# EAGLE design DSP_Lab_SS21_Mainboard (EAGLE 6.6.0)

## Sheet 1 of 4
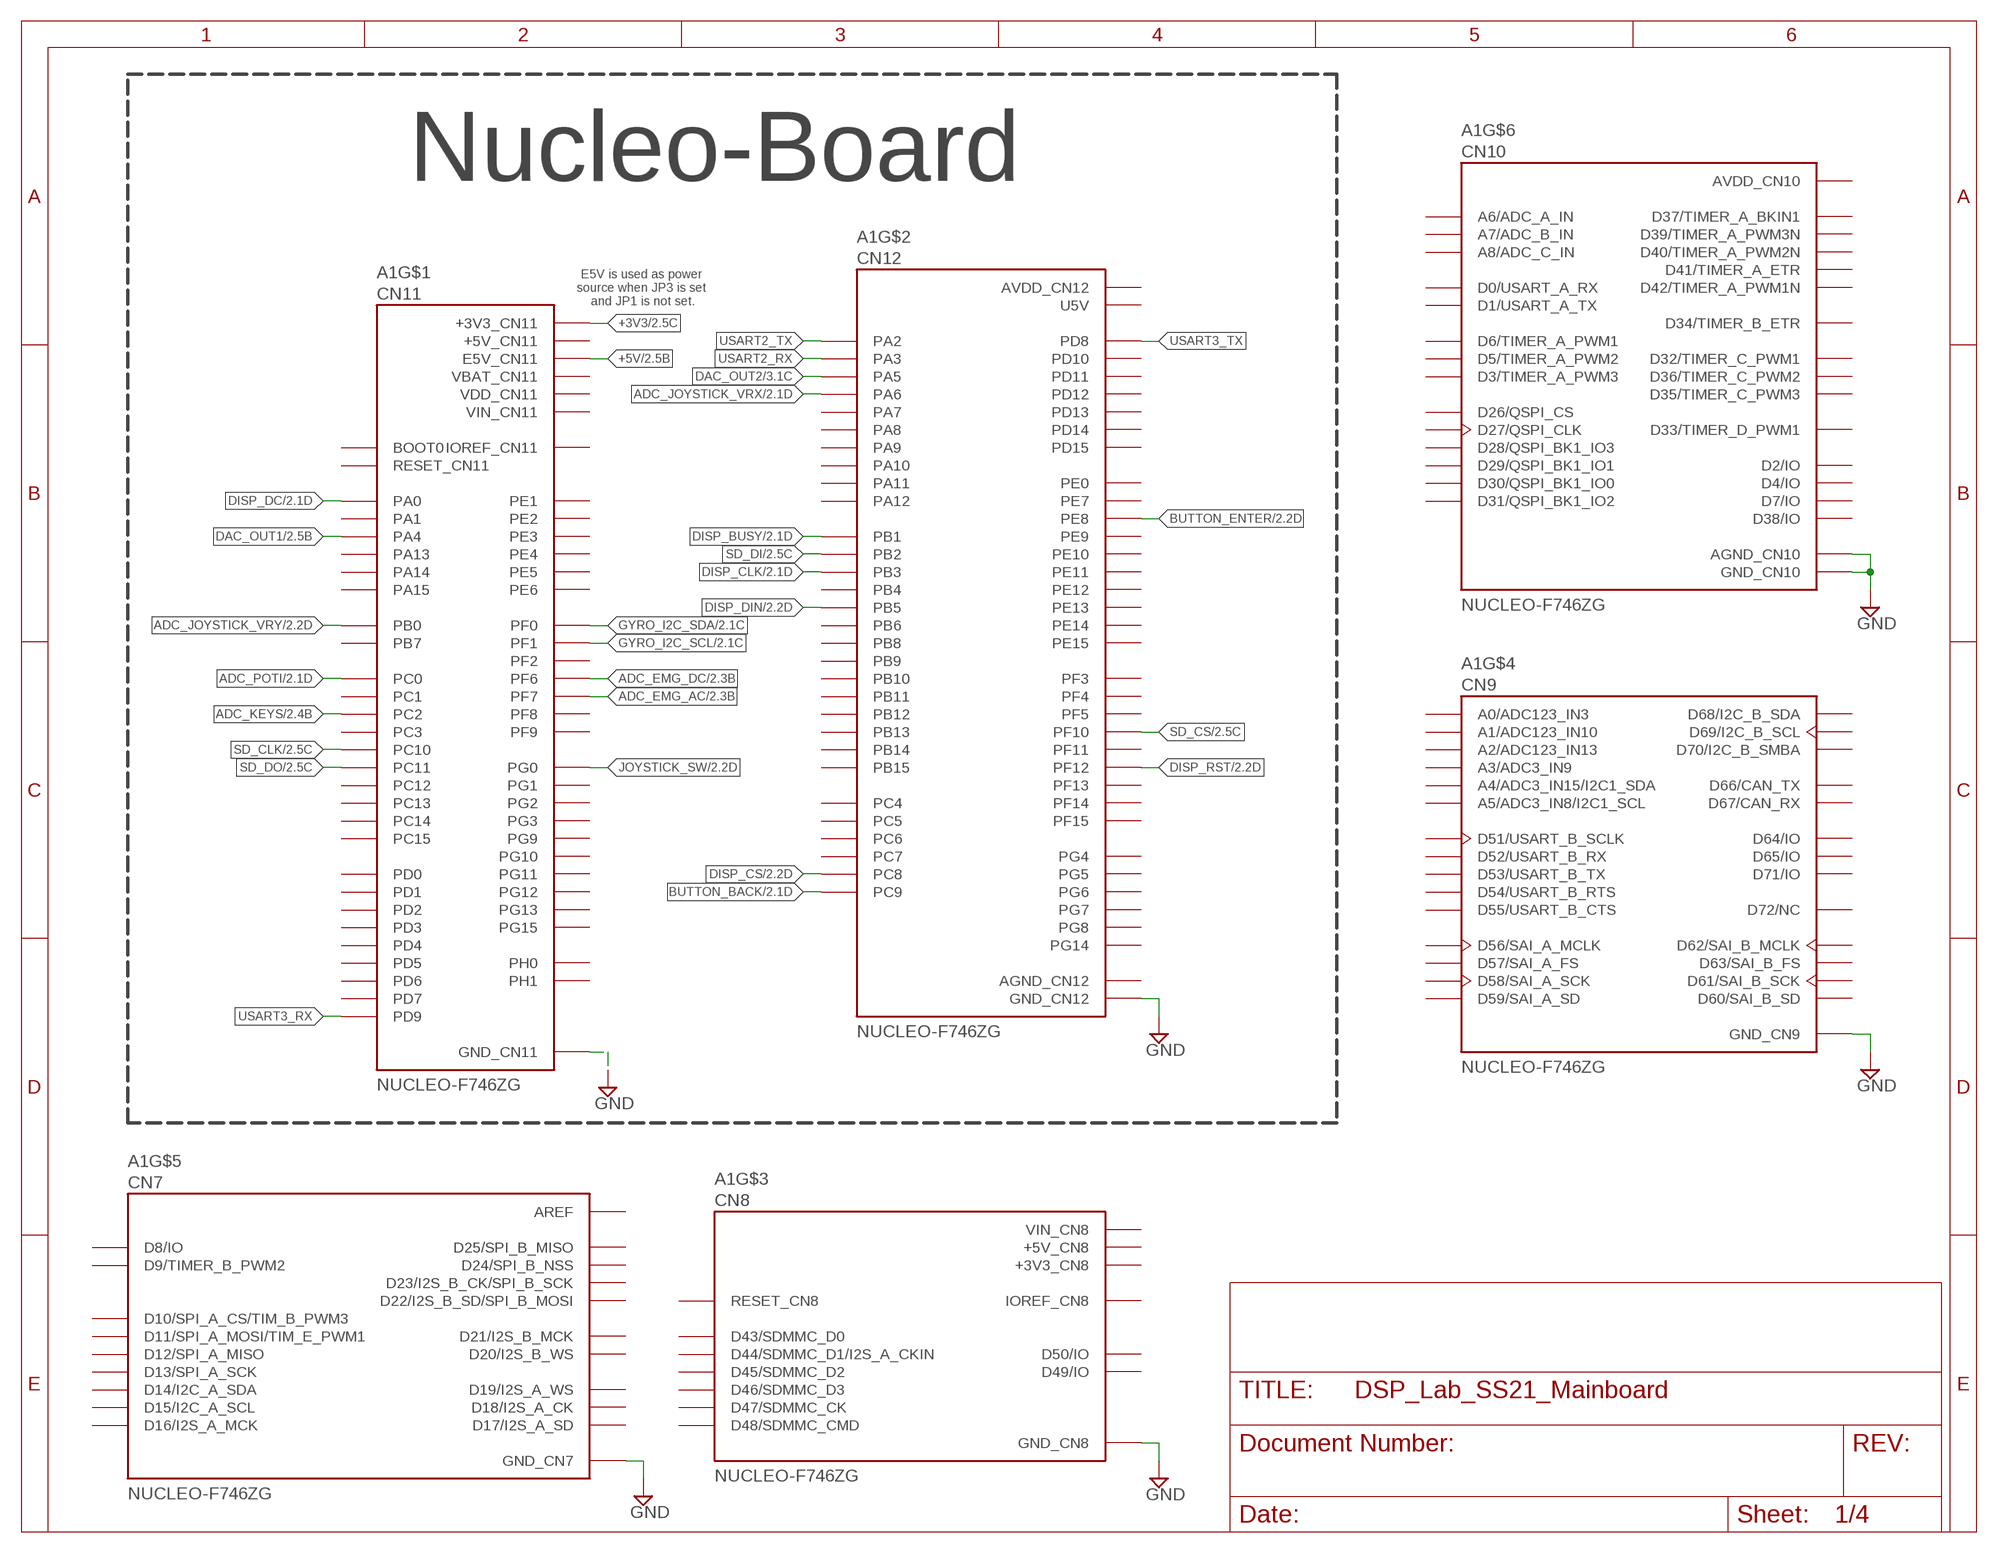
[diagram p0: schematic, sheet 1]

### Parts
A1  NUCLEO-F746ZG  [MODULE_NUCLEO-F746ZG]

### Nets
+3V3: A1.CN11_16(+3V3_CN11) ; also sheet 2,4
+5V: A1.CN11_6(E5V_CN11) ; also sheet 2,3,4
ADC_EMG_AC: A1.CN11_11(PF7) ; also sheet 2
ADC_EMG_DC: A1.CN11_9(PF6) ; also sheet 2
ADC_JOYSTICK_VRX: A1.CN12_13(PA6) ; also sheet 2,4
ADC_JOYSTICK_VRY: A1.CN11_34(PB0) ; also sheet 2,4
ADC_KEYS: A1.CN11_35(PC2) ; also sheet 2
ADC_POTI: A1.CN11_38(PC0) ; also sheet 2,4
BUTTON_BACK: A1.CN12_1(PC9) ; also sheet 2
BUTTON_ENTER: A1.CN12_40(PE8) ; also sheet 2
DAC_OUT1: A1.CN11_32(PA4) ; also sheet 2,3
DAC_OUT2: A1.CN12_11(PA5) ; also sheet 3
DISP_BUSY: A1.CN12_24(PB1) ; also sheet 2
DISP_CLK: A1.CN12_31(PB3) ; also sheet 2
DISP_CS: A1.CN12_2(PC8) ; also sheet 2
DISP_DC: A1.CN11_28(PA0) ; also sheet 2
DISP_DIN: A1.CN12_29(PB5) ; also sheet 2
DISP_RST: A1.CN12_59(PF12) ; also sheet 2
GND: A1.CN7_8(GND_CN7) A1.CN8_11(GND_CN8) A1.CN8_13(GND_CN8) A1.CN9_12(GND_CN9) A1.CN9_23(GND_CN9) A1.CN10_3(AGND_CN10) A1.CN10_5(GND_CN10) A1.CN10_17(GND_CN10) A1.CN10_22(GND_CN10) A1.CN10_27(GND_CN10) A1.CN11_8(GND_CN11) A1.CN11_19(GND_CN11) A1.CN11_20(GND_CN11) A1.CN11_22(GND_CN11) A1.CN11_49(GND_CN11) A1.CN11_60(GND_CN11) A1.CN11_71(GND_CN11) A1.CN11_72(GND_CN11) A1.CN12_9(GND_CN12) A1.CN12_20(GND_CN12) A1.CN12_39(GND_CN12) A1.CN12_54(GND_CN12) A1.CN12_63(GND_CN12) A1.CN12_71(GND_CN12) A1.CN12_72(GND_CN12) ; also sheet 2,3,4
GYRO_I2C_SCL: A1.CN11_51(PF1) ; also sheet 2
GYRO_I2C_SDA: A1.CN11_53(PF0) ; also sheet 2
JOYSTICK_SW: A1.CN11_59(PG0) ; also sheet 2
SD_CLK: A1.CN11_1(PC10) ; also sheet 2
SD_CS: A1.CN12_42(PF10) ; also sheet 2
SD_DI: A1.CN12_22(PB2) ; also sheet 2
SD_DO: A1.CN11_2(PC11) ; also sheet 2
USART2_RX: A1.CN12_37(PA3)
USART2_TX: A1.CN12_35(PA2)
USART3_RX: A1.CN11_69(PD9)
USART3_TX: A1.CN12_10(PD8)
Unconnected: A1.CN7_1(D16/I2S_A_MCK) A1.CN7_2(D15/I2C_A_SCL) A1.CN7_3(D17/I2S_A_SD) A1.CN7_4(D14/I2C_A_SDA) A1.CN7_5(D18/I2S_A_CK) A1.CN7_7(D19/I2S_A_WS) A1.CN7_9(D20/I2S_B_WS) A1.CN7_10(D13/SPI_A_SCK) A1.CN7_11(D21/I2S_B_MCK) A1.CN7_12(D12/SPI_A_MISO) A1.CN7_13(D22/I2S_B_SD/SPI_B_MOSI) A1.CN7_14(D11/SPI_A_MOSI/TIM_E_PWM1) A1.CN7_15(D23/I2S_B_CK/SPI_B_SCK) A1.CN7_16(D10/SPI_A_CS/TIM_B_PWM3) A1.CN7_17(D24/SPI_B_NSS) A1.CN7_18(D9/TIMER_B_PWM2) A1.CN7_19(D25/SPI_B_MISO) A1.CN7_20(D8/IO) A1.CN8_2(D43/SDMMC_D0) A1.CN8_3(IOREF_CN8) A1.CN8_4(D44/SDMMC_D1/I2S_A_CKIN) A1.CN8_5(RESET_CN8) A1.CN8_6(D45/SDMMC_D2) A1.CN8_8(D46/SDMMC_D3) A1.CN8_10(D47/SDMMC_CK) A1.CN8_12(D48/SDMMC_CMD) A1.CN8_14(D49/IO) A1.CN8_16(D50/IO) A1.CN9_1(A0/ADC123_IN3) A1.CN9_2(D51/USART_B_SCLK) A1.CN9_3(A1/ADC123_IN10) A1.CN9_4(D52/USART_B_RX) A1.CN9_5(A2/ADC123_IN13) A1.CN9_6(D53/USART_B_TX) A1.CN9_7(A3/ADC3_IN9) A1.CN9_8(D54/USART_B_RTS) A1.CN9_9(A4/ADC3_IN15/I2C1_SDA) A1.CN9_10(D55/USART_B_CTS) A1.CN9_11(A5/ADC3_IN8/I2C1_SCL) A1.CN9_13(D72/NC) A1.CN9_14(D56/SAI_A_MCLK) A1.CN9_15(D71/IO) A1.CN9_16(D57/SAI_A_FS) A1.CN9_17(D70/I2C_B_SMBA) A1.CN9_18(D58/SAI_A_SCK) A1.CN9_19(D69/I2C_B_SCL) A1.CN9_20(D59/SAI_A_SD) A1.CN9_21(D68/I2C_B_SDA) A1.CN9_22(D60/SAI_B_SD) A1.CN9_24(D61/SAI_B_SCK) A1.CN9_25(D67/CAN_RX) A1.CN9_26(D62/SAI_B_MCLK) A1.CN9_27(D66/CAN_TX) A1.CN9_28(D63/SAI_B_FS) A1.CN9_29(D65/IO) A1.CN9_30(D64/IO) A1.CN10_2(D7/IO) A1.CN10_4(D6/TIMER_A_PWM1) A1.CN10_6(D5/TIMER_A_PWM2) A1.CN10_7(A6/ADC_A_IN) A1.CN10_8(D4/IO) A1.CN10_9(A7/ADC_B_IN) A1.CN10_10(D3/TIMER_A_PWM3) A1.CN10_11(A8/ADC_C_IN) A1.CN10_12(D2/IO) A1.CN10_13(D26/QSPI_CS) A1.CN10_14(D1/USART_A_TX) A1.CN10_15(D27/QSPI_CLK) A1.CN10_16(D0/USART_A_RX) A1.CN10_18(D42/TIMER_A_PWM1N) A1.CN10_19(D28/QSPI_BK1_IO3) A1.CN10_20(D41/TIMER_A_ETR) A1.CN10_21(D29/QSPI_BK1_IO1) A1.CN10_23(D30/QSPI_BK1_IO0) A1.CN10_24(D40/TIMER_A_PWM2N) A1.CN10_25(D31/QSPI_BK1_IO2) A1.CN10_26(D39/TIMER_A_PWM3N) A1.CN10_28(D38/IO) A1.CN10_29(D32/TIMER_C_PWM1) A1.CN10_30(D37/TIMER_A_BKIN1) A1.CN10_31(D33/TIMER_D_PWM1) A1.CN10_32(D36/TIMER_C_PWM2) A1.CN10_33(D34/TIMER_B_ETR) A1.CN10_34(D35/TIMER_C_PWM3) A1.CN11_3(PC12) A1.CN11_4(PD2) A1.CN11_7(BOOT0) A1.CN11_12(IOREF_CN11) A1.CN11_13(PA13) A1.CN11_14(RESET_CN11) A1.CN11_15(PA14) A1.CN11_17(PA15) A1.CN11_21(PB7) A1.CN11_23(PC13) A1.CN11_25(PC14) A1.CN11_27(PC15) A1.CN11_29(PH0) A1.CN11_30(PA1) A1.CN11_31(PH1) A1.CN11_36(PC1) A1.CN11_37(PC3) A1.CN11_39(PD4) A1.CN11_40(PD3) A1.CN11_41(PD5) A1.CN11_42(PG2) A1.CN11_43(PD6) A1.CN11_44(PG3) A1.CN11_45(PD7) A1.CN11_46(PE2) A1.CN11_47(PE3) A1.CN11_48(PE4) A1.CN11_50(PE5) A1.CN11_52(PF2) A1.CN11_54(PF8) A1.CN11_55(PD1) A1.CN11_56(PF9) A1.CN11_57(PD0) A1.CN11_58(PG1) A1.CN11_61(PE1) A1.CN11_62(PE6) A1.CN11_63(PG9) A1.CN11_64(PG15) A1.CN11_65(PG12) A1.CN11_66(PG10) A1.CN11_68(PG13) A1.CN11_70(PG11) A1.CN12_3(PB8) A1.CN12_4(PC6) A1.CN12_5(PB9) A1.CN12_6(PC5) A1.CN12_12(PA12) A1.CN12_14(PA11) A1.CN12_15(PA7) A1.CN12_16(PB12) A1.CN12_17(PB6) A1.CN12_18(PB11) A1.CN12_19(PC7) A1.CN12_21(PA9) A1.CN12_23(PA8) A1.CN12_25(PB10) A1.CN12_26(PB15) A1.CN12_27(PB4) A1.CN12_28(PB14) A1.CN12_30(PB13) A1.CN12_33(PA10) A1.CN12_34(PC4) A1.CN12_36(PF5) A1.CN12_38(PF4) A1.CN12_41(PD13) A1.CN12_43(PD12) A1.CN12_44(PE7) A1.CN12_45(PD11) A1.CN12_46(PD14) A1.CN12_47(PE10) A1.CN12_48(PD15) A1.CN12_49(PE12) A1.CN12_50(PF14) A1.CN12_51(PE14) A1.CN12_52(PE9) A1.CN12_53(PE15) A1.CN12_55(PE13) A1.CN12_56(PE11) A1.CN12_57(PF13) A1.CN12_58(PF3) A1.CN12_60(PF15) A1.CN12_61(PG14) A1.CN12_62(PF11) A1.CN12_64(PE0) A1.CN12_65(PD10) A1.CN12_66(PG8) A1.CN12_67(PG7) A1.CN12_68(PG5) A1.CN12_69(PG4) A1.CN12_70(PG6)

### Notes on the sheet
- Nucleo-Board
- E5V is used as power 
  source when JP3 is set 
  and JP1 is not set.

## Sheet 2 of 4
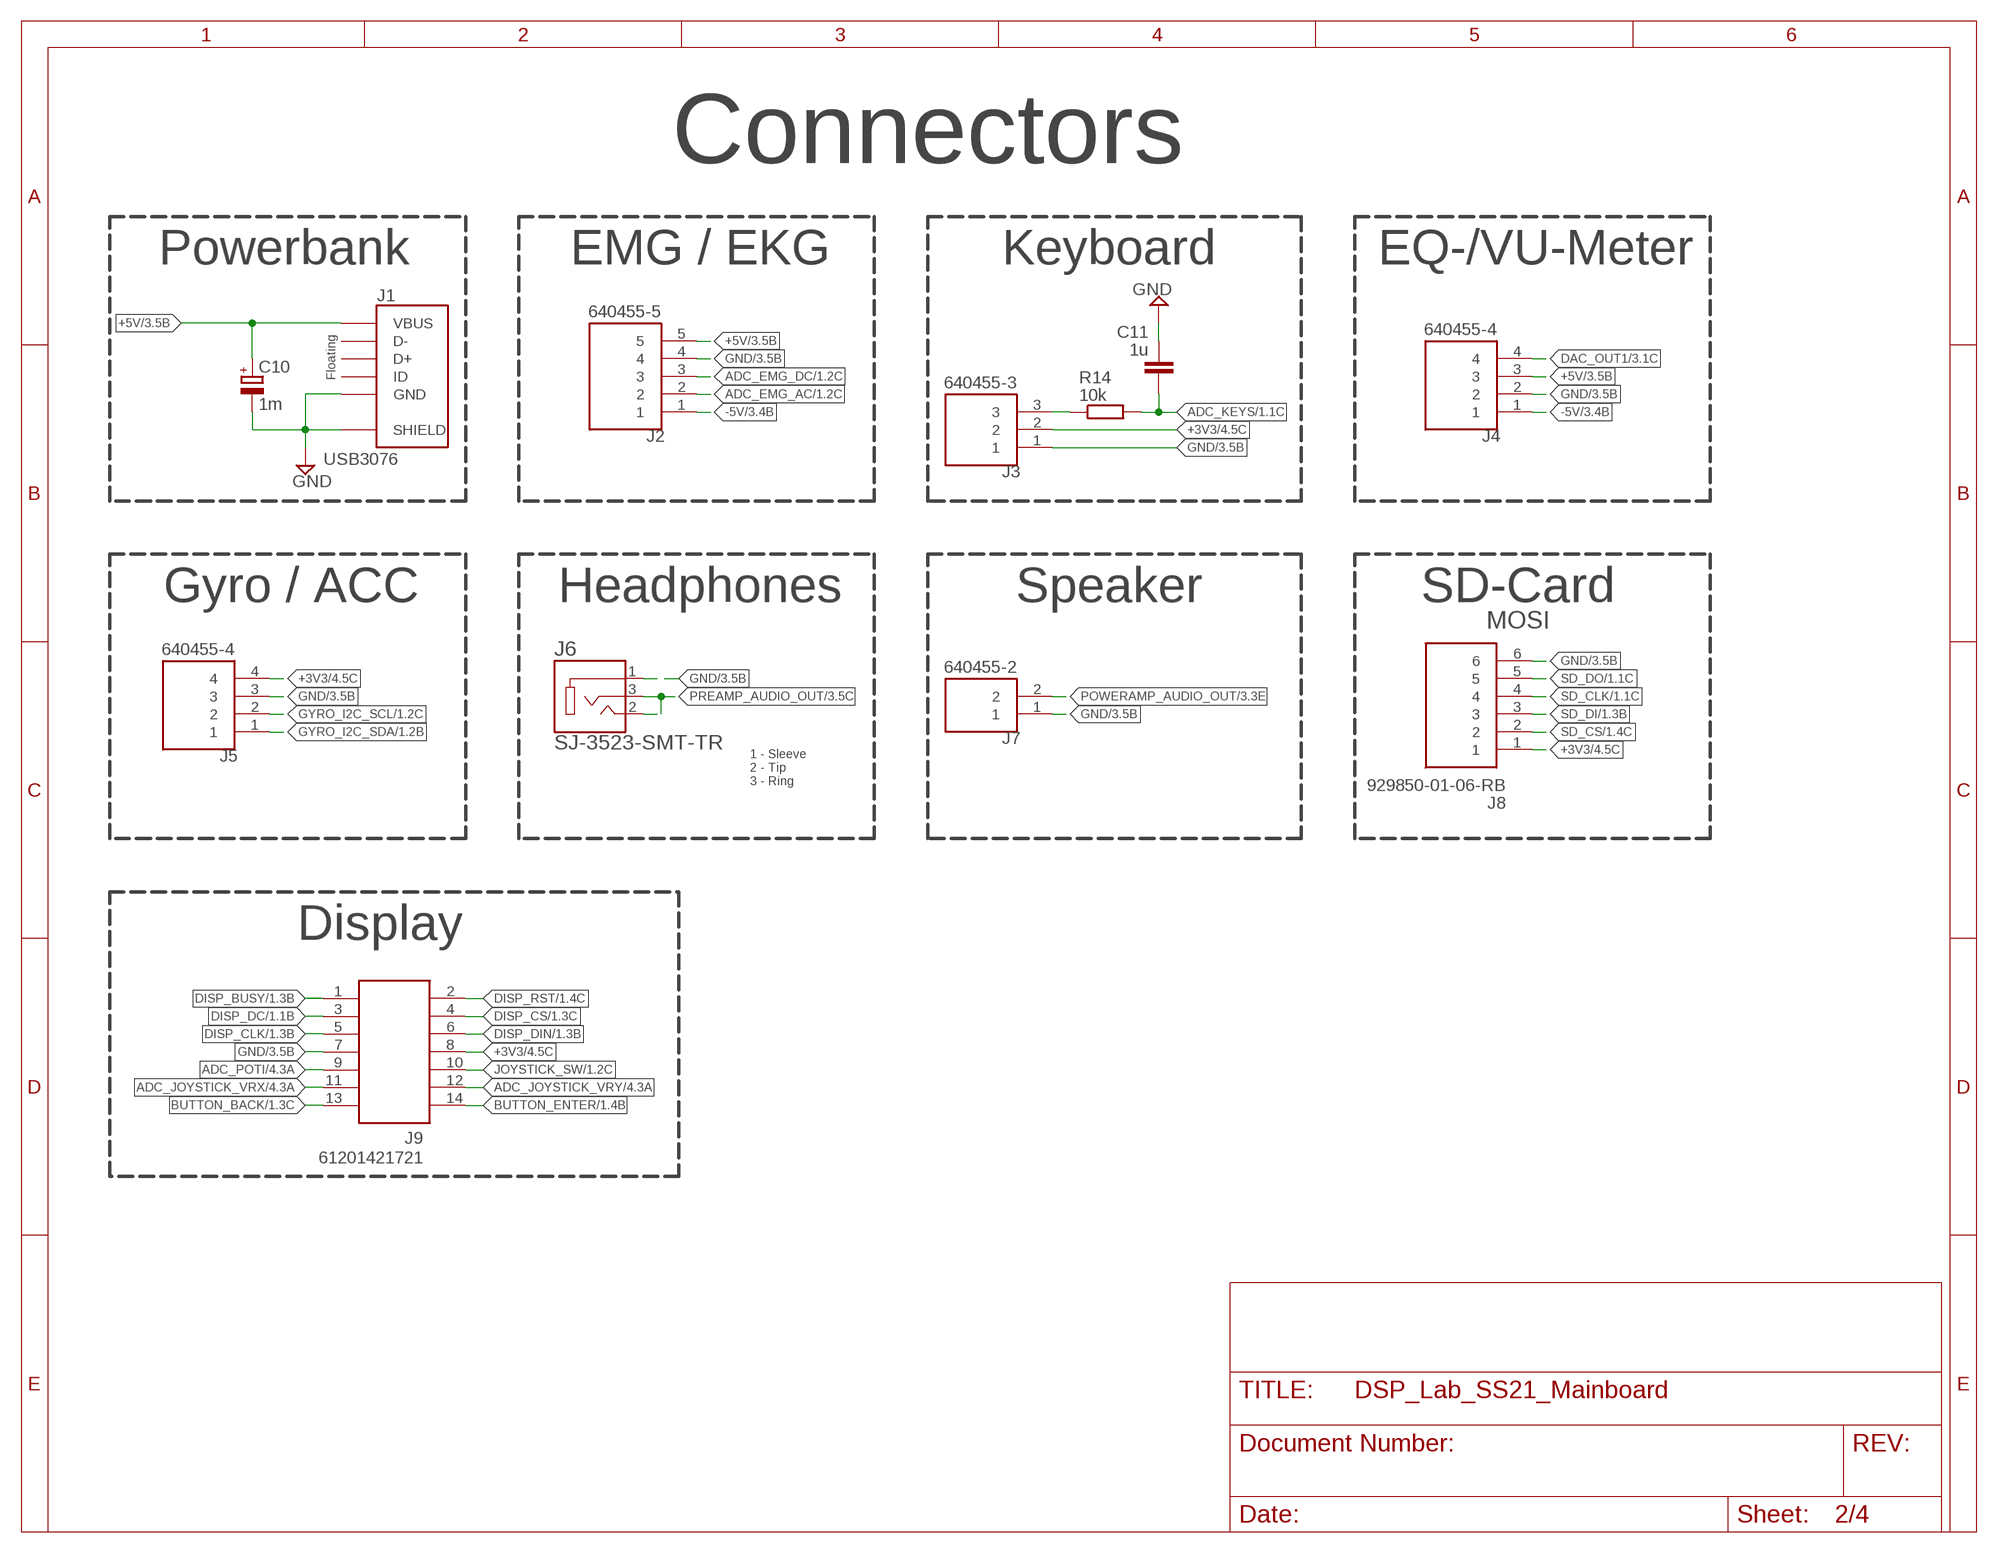
[diagram p1: schematic, sheet 2]

### Parts
C10  1m  CPOL-EUE2.5-5  [E2,5-5]
C11  1u  C-EUC0603  [C0603]
J1  USB3076  USB3076-XX-X_REVC  [GCT_USB3076-XX-X_REVC]
J2  640455-5  [TE_640455-5]
J3  640455-3  [TE_640455-3]
J4  640455-4  [TE_640455-4]
J5  640455-4  [TE_640455-4]
J6  SJ-3523-SMT-TR  [CUI_SJ-3523-SMT-TR]
J7  640455-2  [TE_640455-2]
J8  929850-01-06-RB  [RHDR6W76P0X254_1X6_1524X254X82]
J9  61201421721  [61201421721]
R14  10k  R-EU_R0603  [R0603]

### Nets
+3V3: J3.2 J5.4 J8.1 J9.8 ; also sheet 1,4
+5V: C10.+ J1.1(VBUS) J2.5 J4.3 ; also sheet 1,3,4
-5V: J2.1 J4.1 ; also sheet 3,4
ADC_EMG_AC: J2.2 ; also sheet 1
ADC_EMG_DC: J2.3 ; also sheet 1
ADC_JOYSTICK_VRX: J9.11 ; also sheet 1,4
ADC_JOYSTICK_VRY: J9.12 ; also sheet 1,4
ADC_KEYS: C11.1 R14.2 ; also sheet 1
ADC_POTI: J9.9 ; also sheet 1,4
BUTTON_BACK: J9.13 ; also sheet 1
BUTTON_ENTER: J9.14 ; also sheet 1
DAC_OUT1: J4.4 ; also sheet 1,3
DISP_BUSY: J9.1 ; also sheet 1
DISP_CLK: J9.5 ; also sheet 1
DISP_CS: J9.4 ; also sheet 1
DISP_DC: J9.3 ; also sheet 1
DISP_DIN: J9.6 ; also sheet 1
DISP_RST: J9.2 ; also sheet 1
GND: C10.- C11.2 J1.5(GND) J1.6(SHIELD) J1.7(SHIELD) J1.8(SHIELD) J1.9(SHIELD) J1.10(SHIELD) J1.11(SHIELD) J2.4 J3.1 J4.2 J5.3 J6.1 J7.1 J8.6 J9.7 ; also sheet 1,3,4
GYRO_I2C_SCL: J5.2 ; also sheet 1
GYRO_I2C_SDA: J5.1 ; also sheet 1
JOYSTICK_SW: J9.10 ; also sheet 1
N$1: J3.3 R14.1
POWERAMP_AUDIO_OUT: J7.2 ; also sheet 3
PREAMP_AUDIO_OUT: J6.2 J6.3 ; also sheet 3
SD_CLK: J8.4 ; also sheet 1
SD_CS: J8.2 ; also sheet 1
SD_DI: J8.3 ; also sheet 1
SD_DO: J8.5 ; also sheet 1
Unconnected: J1.2(D-) J1.3(D+) J1.4(ID)

### Notes on the sheet
- Connectors
- Powerbank | EMG / EKG | Keyboard | EQ-/VU-Meter
- Floating
- Gyro / ACC | Headphones | Speaker | SD-Card
- MOSI
- 1 - Sleeve
  2 - Tip
  3 - Ring
- Display

## Sheet 3 of 4
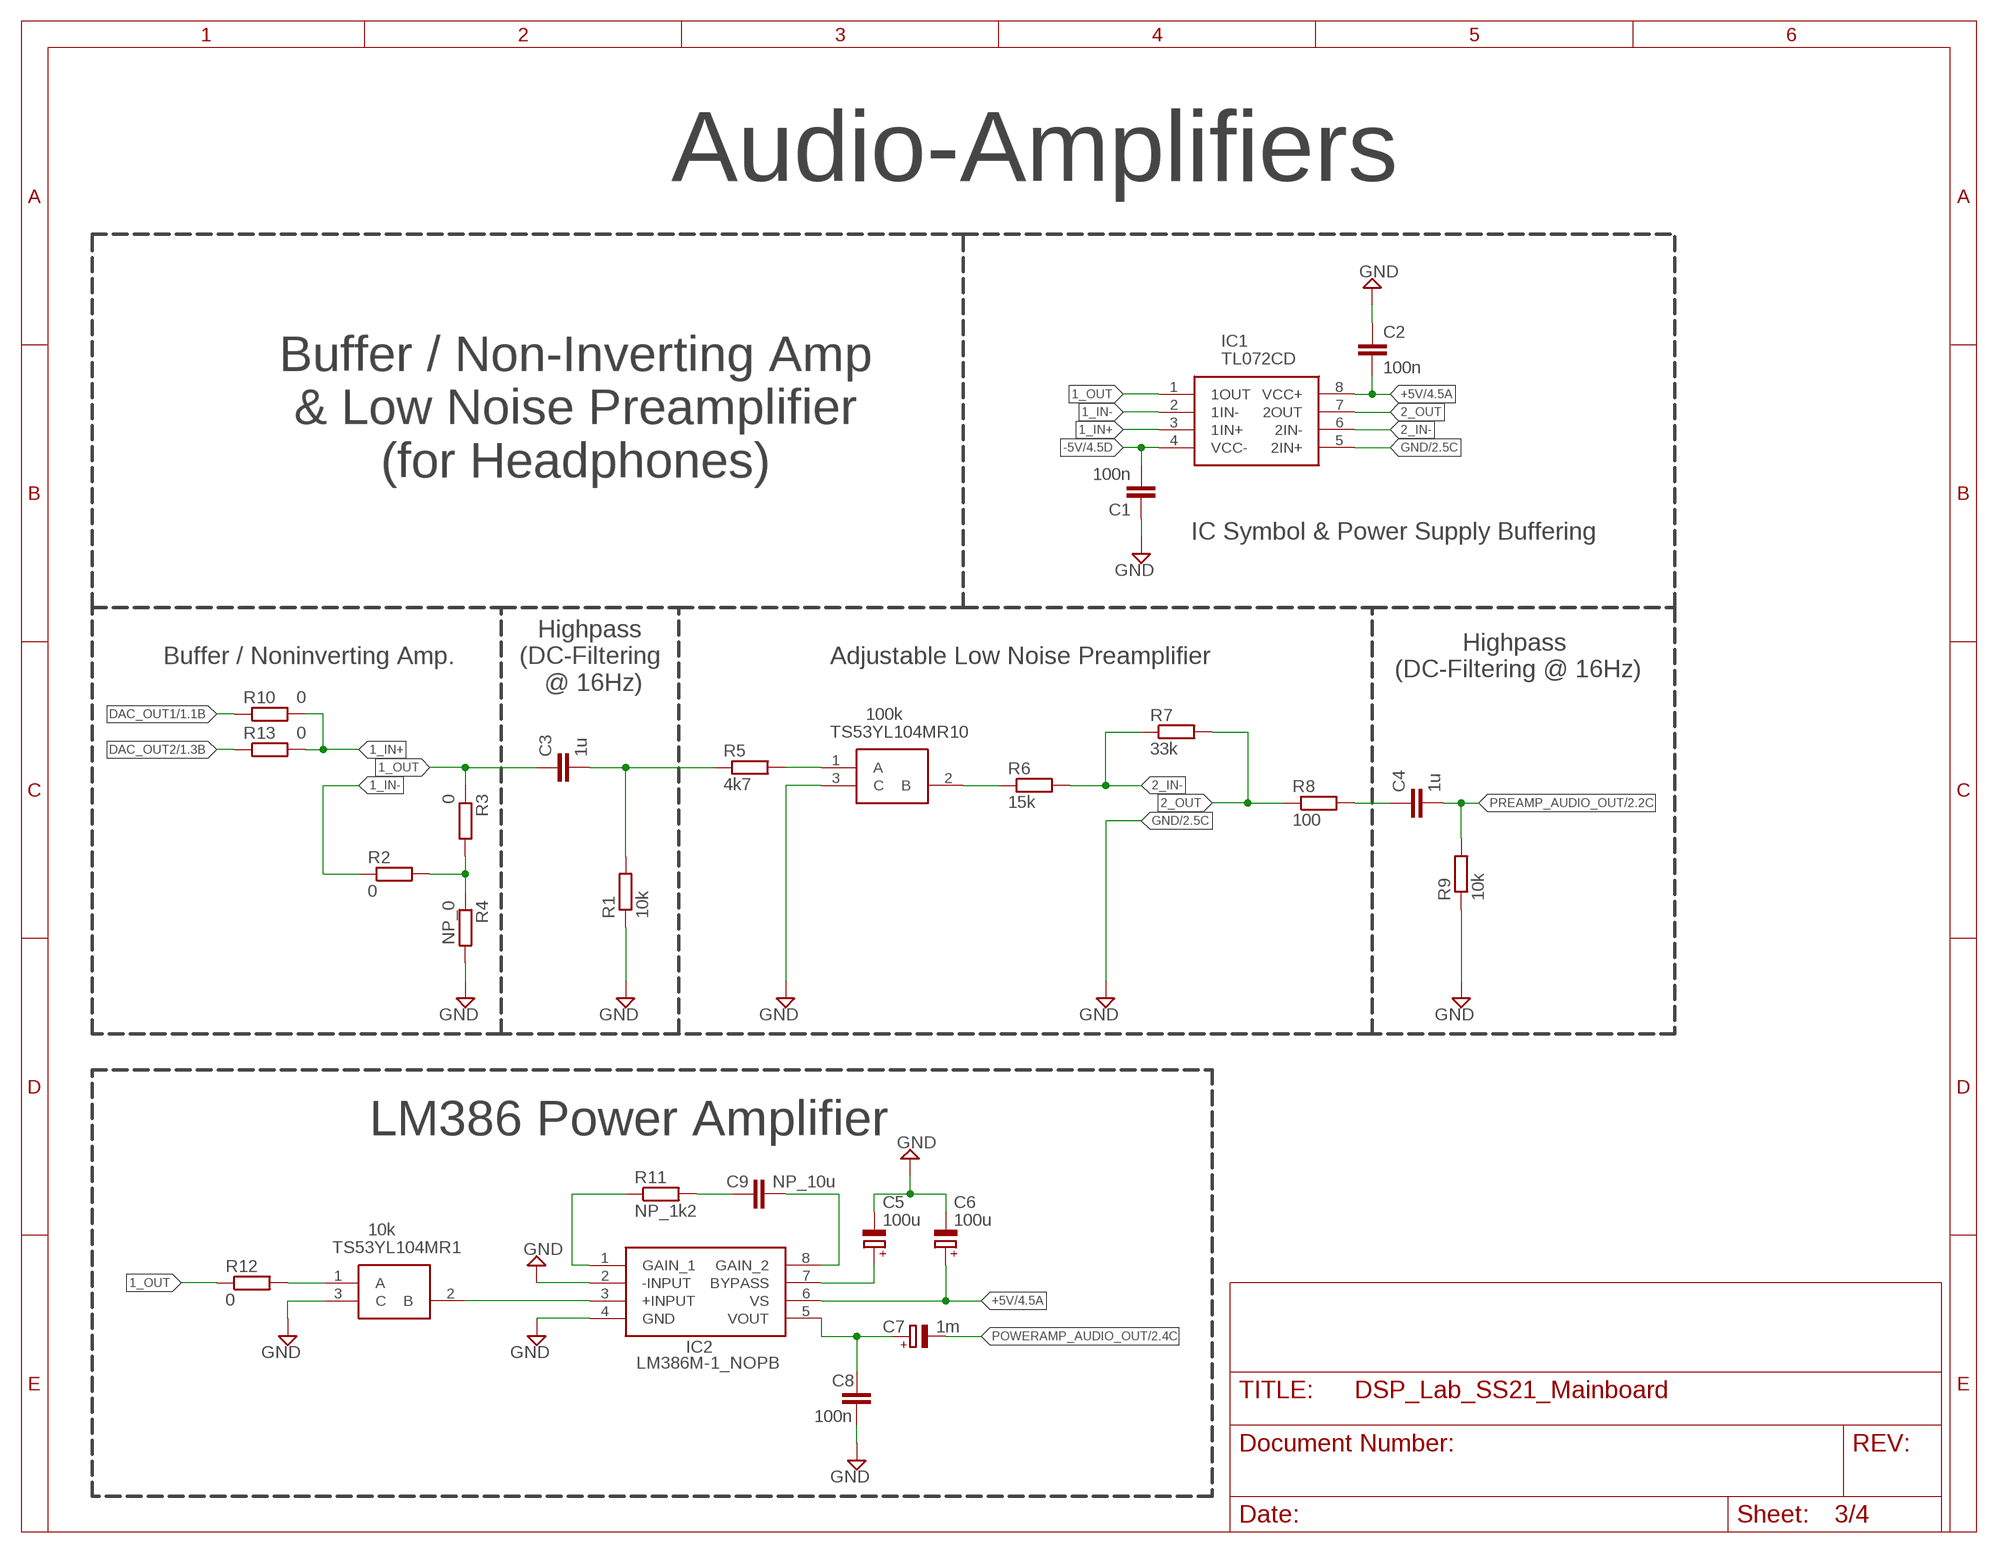
[diagram p2: schematic, sheet 3]

### Parts
C1  100n  C-EUC0603  [C0603]
C2  100n  C-EUC0603  [C0603]
C3  1u  C-EUC0603  [C0603]
C4  1u  C-EUC0603  [C0603]
C5  100u  CPOL-EUE2.5-5  [E2,5-5]
C6  100u  CPOL-EUE2.5-5  [E2,5-5]
C7  1m  CPOL-EUE2.5-5  [E2,5-5]
C8  100n  C-EUC0603  [C0603]
C9  NP_10u  C-EUC0603  [C0603]
IC1  TL072CD  [SOIC127P600X175-8N]
IC2  LM386M-1_NOPB  [SOIC127P600X175-8N]
R1  10k  R-EU_R0603  [R0603]
R2  0  R-EU_R0603  [R0603]
R3  0  R-EU_R0603  [R0603]
R4  NP_0  R-EU_R0603  [R0603]
R5  4k7  R-EU_R0603  [R0603]
R6  15k  R-EU_R0603  [R0603]
R7  33k  R-EU_R0603  [R0603]
R8  100  R-EU_R0603  [R0603]
R9  10k  R-EU_R0603  [R0603]
R10  0  R-EU_R0603  [R0603]
R11  NP_1k2  R-EU_R0603  [R0603]
R12  0  R-EU_R0603  [R0603]
R13  0  R-EU_R0603  [R0603]
TS53YL104MR1  10k  TS53YL203MR10  [TS53YL203MR10]
TS53YL104MR10  100k  TS53YL203MR10  [TS53YL203MR10]

### Nets
1_IN+: IC1.3(1IN+) R10.2 R13.2
1_IN-: IC1.2(1IN-) R2.1
1_OUT: C3.1 IC1.1(1OUT) R3.1 R12.1
2_IN-: IC1.6(2IN-) R6.2 R7.1
2_OUT: IC1.7(2OUT) R7.2 R8.1
+5V: C2.2 C6.+ IC1.8(VCC+) IC2.6(VS) ; also sheet 1,2,4
-5V: C1.2 IC1.4(VCC-) ; also sheet 2,4
DAC_OUT1: R10.1 ; also sheet 1,2
DAC_OUT2: R13.1 ; also sheet 1
GND: C1.1 C2.1 C5.- C6.- C8.2 IC1.5(2IN+) IC2.2(-INPUT) IC2.4(GND) R1.1 R4.2 R9.1 TS53YL104MR1.3(C) TS53YL104MR10.3(C) ; also sheet 1,2,4
N$2: C3.2 R1.2 R5.1
N$19: R2.2 R3.2 R4.1
N$20: R5.2 TS53YL104MR10.1(A)
N$21: R6.1 TS53YL104MR10.2(B)
N$22: C4.1 R8.2
N$23: IC2.1(GAIN_1) R11.1
N$24: IC2.3(+INPUT) TS53YL104MR1.2(B)
N$25: C9.1 R11.2
N$26: C9.2 IC2.8(GAIN_2)
N$27: R12.2 TS53YL104MR1.1(A)
N$28: C5.+ IC2.7(BYPASS)
N$29: C7.+ C8.1 IC2.5(VOUT)
POWERAMP_AUDIO_OUT: C7.- ; also sheet 2
PREAMP_AUDIO_OUT: C4.2 R9.2 ; also sheet 2

### Notes on the sheet
- Audio-Amplifiers
- Buffer / Non-Inverting Amp
  & Low Noise Preamplifier
  (for Headphones)
- IC Symbol & Power Supply Buffering
- Buffer / Noninverting Amp.
- Highpass 
  (DC-Filtering 
  @ 16Hz)
- Adjustable Low Noise Preamplifier
- Highpass 
  (DC-Filtering @ 16Hz)
- LM386 Power Amplifier

## Sheet 4 of 4
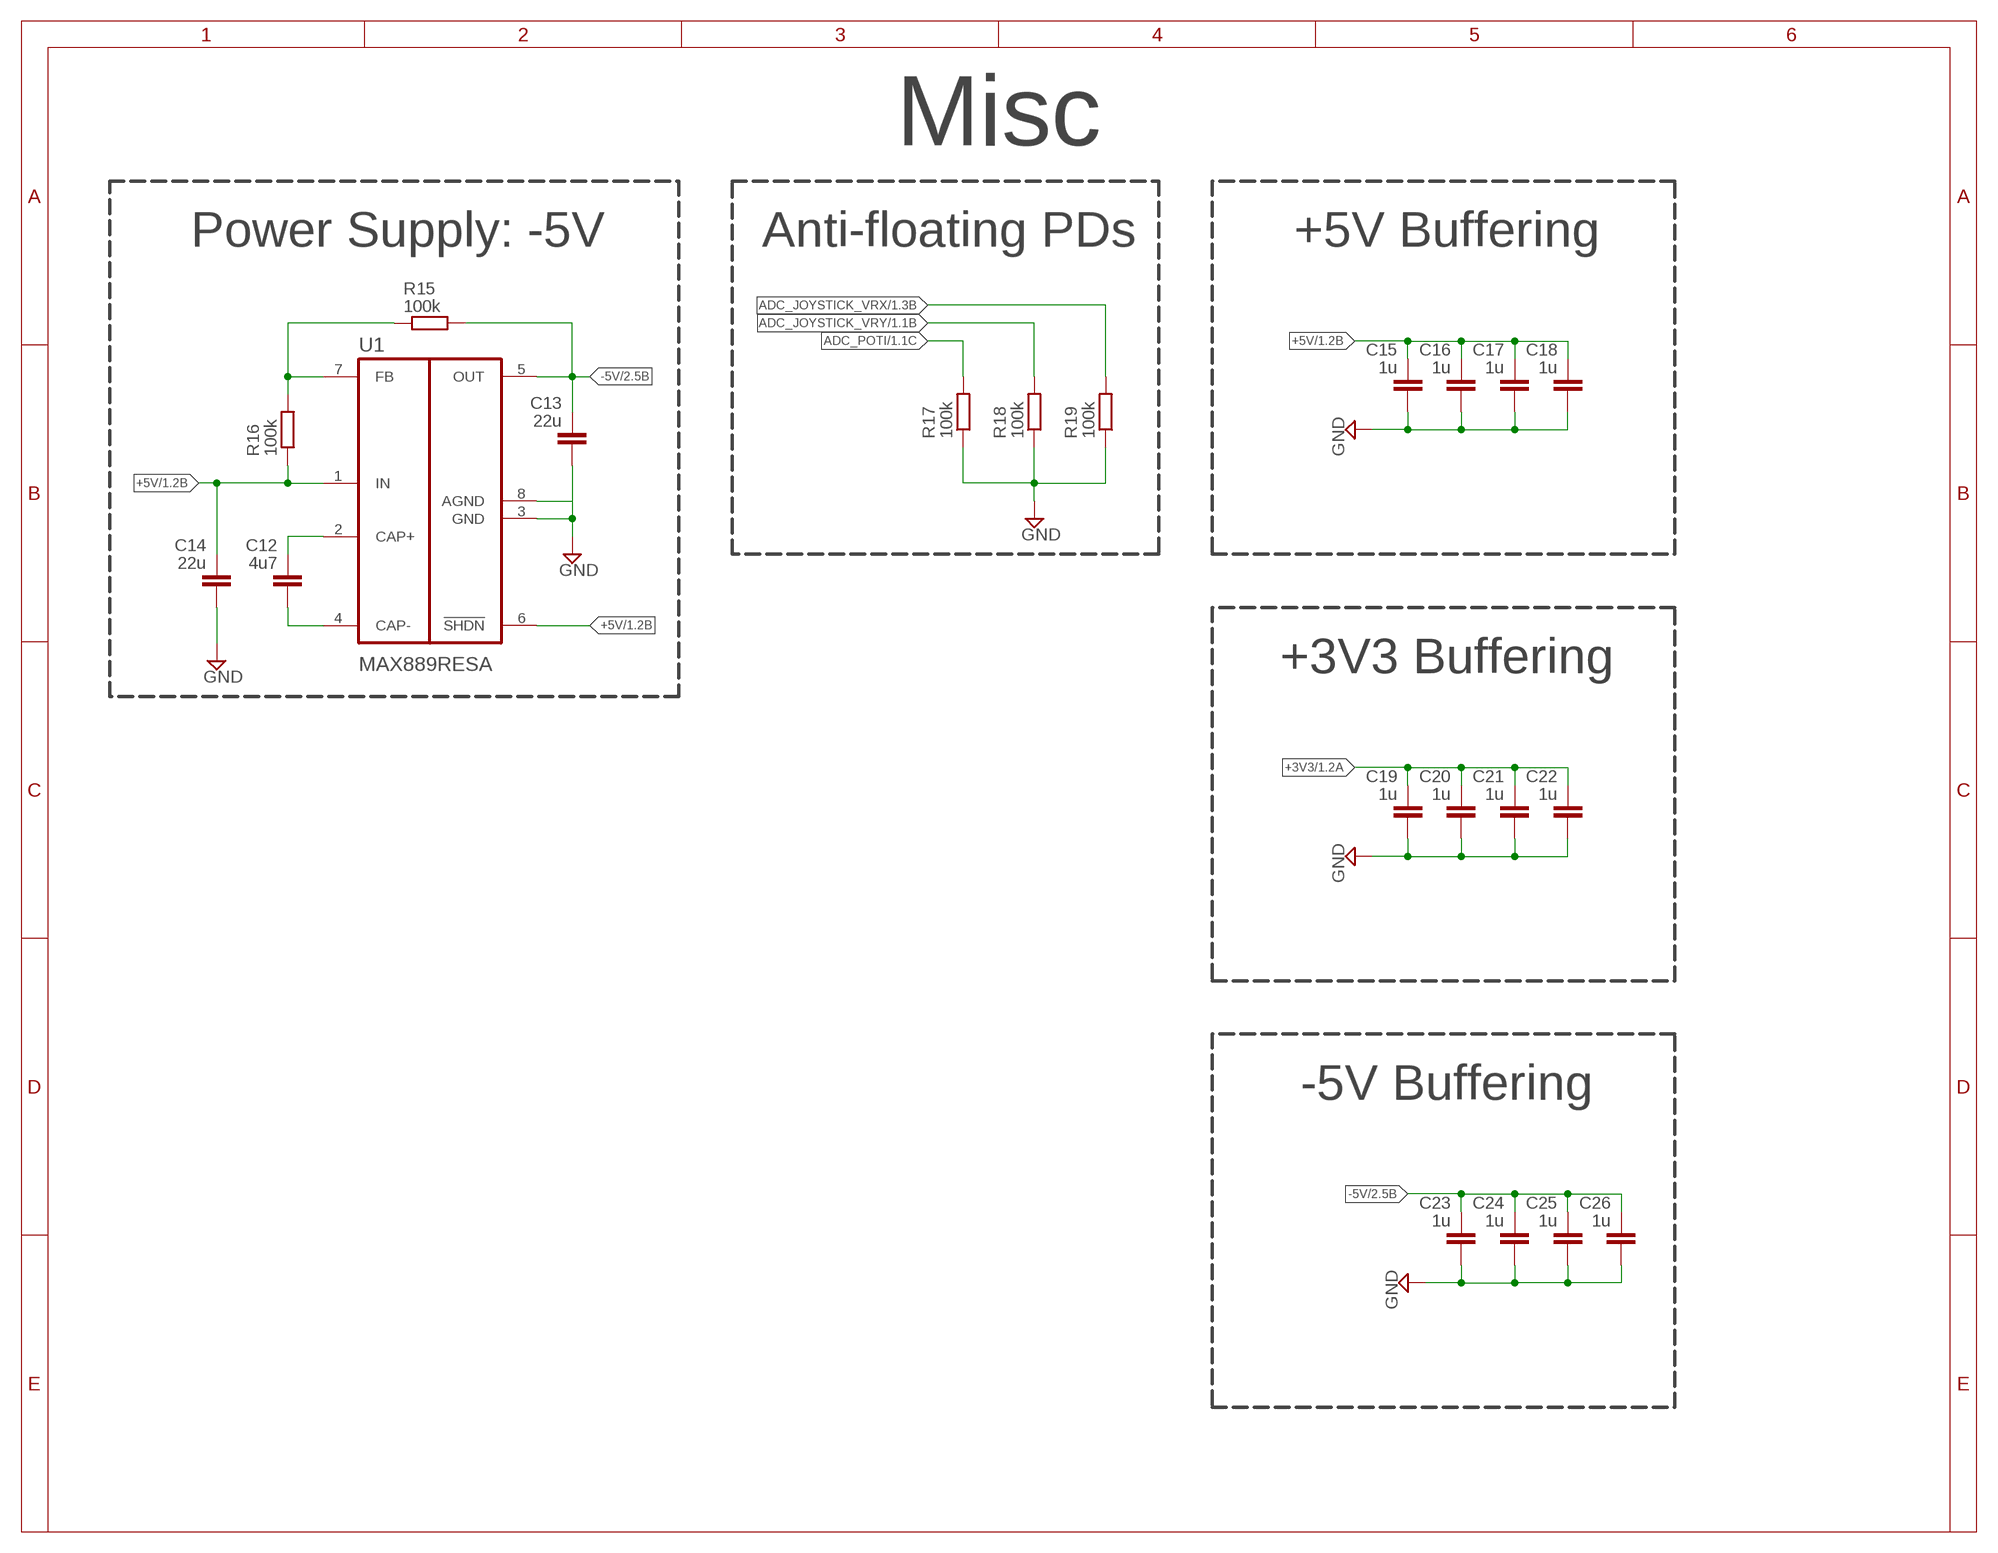
[diagram p3: schematic, sheet 4]

### Parts
C12  4u7  C-EUC0603  [C0603]
C13  22u  C-EUC0603  [C0603]
C14  22u  C-EUC0603  [C0603]
C15  1u  C-EUC0603  [C0603]
C16  1u  C-EUC0603  [C0603]
C17  1u  C-EUC0603  [C0603]
C18  1u  C-EUC0603  [C0603]
C19  1u  C-EUC0603  [C0603]
C20  1u  C-EUC0603  [C0603]
C21  1u  C-EUC0603  [C0603]
C22  1u  C-EUC0603  [C0603]
C23  1u  C-EUC0603  [C0603]
C24  1u  C-EUC0603  [C0603]
C25  1u  C-EUC0603  [C0603]
C26  1u  C-EUC0603  [C0603]
R15  100k  R-EU_R0603  [R0603]
R16  100k  R-EU_R0603  [R0603]
R17  100k  R-EU_R0603  [R0603]
R18  100k  R-EU_R0603  [R0603]
R19  100k  R-EU_R0603  [R0603]
U1  MAX889RESA  [SOIC127P600X175-8N]

### Nets
+3V3: C19.2 C20.2 C21.2 C22.2 ; also sheet 1,2
+5V: C14.2 C15.2 C16.2 C17.2 C18.2 R16.1 U1.1(IN) U1.6(!SHDN) ; also sheet 1,2,3
-5V: C13.2 C23.2 C24.2 C25.2 C26.2 R15.2 U1.5(OUT) ; also sheet 2,3
ADC_JOYSTICK_VRX: R19.2 ; also sheet 1,2
ADC_JOYSTICK_VRY: R18.2 ; also sheet 1,2
ADC_POTI: R17.2 ; also sheet 1,2
GND: C13.1 C14.1 C15.1 C16.1 C17.1 C18.1 C19.1 C20.1 C21.1 C22.1 C23.1 C24.1 C25.1 C26.1 R17.1 R18.1 R19.1 U1.3(GND) U1.8(AGND) ; also sheet 1,2,3
N$3: R15.1 R16.2 U1.7(FB)
N$5: C12.2 U1.2(CAP+)
N$6: C12.1 U1.4(CAP-)

### Notes on the sheet
- Misc
- Power Supply: -5V | Anti-floating PDs | +5V Buffering
- +3V3 Buffering
- -5V Buffering

## Power pins joined to a net without a drawn wire
+3V3_CN8: A1.CN8_7(+3V3_CN8)
+5V_CN8: A1.CN8_9(+5V_CN8)
+5V_CN11: A1.CN11_18(+5V_CN11)
AGND_CN12: A1.CN12_32(AGND_CN12)
AREF: A1.CN7_6(AREF)
AVDD_CN10: A1.CN10_1(AVDD_CN10)
AVDD_CN12: A1.CN12_7(AVDD_CN12)
U5V: A1.CN12_8(U5V)
VBAT_CN11: A1.CN11_33(VBAT_CN11)
VDD_CN11: A1.CN11_5(VDD_CN11)
VIN_CN8: A1.CN8_15(VIN_CN8)
VIN_CN11: A1.CN11_24(VIN_CN11)

## Library data of the parts
A1 = NUCLEO-F746ZG:NUCLEO-F746ZG: STM32 Nucleo-144 development board with STM32F746ZG MCU, supports Arduino, ST Zio and morpho connectivity Check prices <https://pricing.snapeda.com/parts/NUCLEO-F746ZG/STMicroelectronics/view-part?ref=eda>; AVAILABILITY: In Stock; DESCRIPTION: STM32F746ZG, mbed-Enabled Development Nucleo-144 STM32F7 ARM® Cortex®-M7 MCU 32-Bit Embedded Evaluation Board; MF: STMicroelectronics; MP: NUCLEO-F746ZG; PACKAGE: None; PRICE: None
C1-C4 C8 C9 C11-C26 = rcl:C-EU: CAPACITOR, European symbol
C5-C7 C10 = rcl:CPOL-EU: POLARIZED CAPACITOR, European symbol
IC1 = SamacSys_Parts:TL072CD: Dual Low-Noise JFET-Input General-Purpose Operational Amplifier Source: Datasheet <http://www.ti.com/lit/ds/symlink/tl072.pdf>; DESCRIPTION: Dual Low-Noise JFET-Input General-Purpose Operational Amplifier; HEIGHT: 1.75mm; MANUFACTURER_NAME: Texas Instruments; MANUFACTURER_PART_NUMBER: TL072CD; MOUSER_PART_NUMBER: 595-TL072CD; MOUSER_PRICE-STOCK: https://www.mouser.com/Search/Refine.aspx?Keyword=595-TL072CD
IC2 = SamacSys_Parts:LM386M-1_NOPB: Wide Input Voltage Low Power Audio Amplifier with Internal Gain Source: Datasheet; DESCRIPTION: Wide Input Voltage Low Power Audio Amplifier with Internal Gain; HEIGHT: 1.75mm; MANUFACTURER_NAME: Texas Instruments; MANUFACTURER_PART_NUMBER: LM386M-1/NOPB; MOUSER_PART_NUMBER: 926-LM386M-1/NOPB; MOUSER_PRICE-STOCK: https://www.mouser.co.uk/ProductDetail/Texas-Instruments/LM386M-1-NOPB?qs=QbsRYf82W3GaJvrwUmrW3g%3D%3D
J1 = USB3076-XX-X_REVC:USB3076-XX-X_REVC: Micro USB Receptacle, Type B, SMT, Horizontal, Bottom Mount w/out Peg, w/out Shell Stakes, w/out Mating Face Lead-In Check prices <https://pricing.snapeda.com/parts/USB3076-30-A/Global%20Connector%20Technology/view-part?ref=eda>; AVAILABILITY: In Stock; DESCRIPTION: USB - micro B USB 2.0 Receptacle Connector 5 Position Surface Mount, Right Angle; Through Hole, 2.35mm profile, 5 Pins, Horizontal, Bottom mount; MF: Global Connector Technology; MP: USB3076-30-A; PACKAGE: None; PRICE: None
J2 = 640455-5:640455-5; COMMENT: 640455-5; DESCRIPTION: MTA-100 5 Position Through Hole Single Row Right Angle Wire to Board Header; DIGI-KEY_PART_NUMBER: A19453-ND; DIGI-KEY_PURCHASE_URL: https://www.digikey.de/product-detail/en/te-connectivity-amp-connectors/640455-5/A19453-ND/259000?utm_source=snapeda&utm_medium=aggregator&utm_campaign=symbol; MF: TE Connectivity; MP: 640455-5; PACKAGE: None; TE_PURCHASE_URL: https://www.te.com/usa-en/product-640455-5.html?te_bu=Cor&te_type=disp&te_campaign=seda_glo_cor-seda-global-disp-prtnr-fy19-seda-model-bom-cta_sma-317_1&elqCampaignId=32493
J3 = 640455-3:640455-3: Check prices <https://pricing.snapeda.com/parts/640455-3/TE%20Connectivity/view-part?ref=eda>; AVAILABILITY: In Stock; COMMENT: 640455-3; DESCRIPTION: Connector Header Through Hole, Right Angle 3 position 0.100 (2.54mm); EU_ROHS_COMPLIANCE: Compliant; MF: TE Connectivity; MP: 640455-3; PACKAGE: None; PRICE: None; PURCHASE-URL: https://pricing.snapeda.com/search/part/640455-3/?ref=eda
J4 J5 = 640455-4:640455-4: Check prices <https://pricing.snapeda.com/parts/640455-4/TE%20Connectivity/view-part?ref=eda>; AVAILABILITY: In Stock; COMMENT: 640455-4; DESCRIPTION: Headers & Receptacles cable a placa 8 POS MONO SHAPE MKII TAB ASS'Y GW 750.N TYCO / TE CONNECTIVITY; EU_ROHS_COMPLIANCE: Compliant; MF: TE Connectivity; MP: 640455-4; PACKAGE: None; PRICE: None
J6 = SJ-3523-SMT-TR:SJ-3523-SMT-TR: Audio Jack Connector 3.5 mm Low Profile Surface Mount Stereo Jack, 3 Pin Right-Angle Check prices <https://pricing.snapeda.com/parts/SJ-3523-SMT-TR/CUI%20Devices/view-part?ref=eda>; AVAILABILITY: In Stock; CUI_PURCHASE_URL: https://www.cuidevices.com/product/interconnect/connectors/audio-connectors/jacks/sj-352x-smt-series?utm_source=snapeda.com&utm_medium=referral&utm_campaign=snapedaBOM; DESCRIPTION: 3.5 mm, Stereo, Right Angle, Surface Mount (SMT), 3 Conductors, 0~1 Internal Switches, Audio Jack Connector; MF: CUI Devices; MP: SJ-3523-SMT-TR; PACKAGE: LGA-10 STMicroelectronics; PRICE: None
J7 = 640455-2:640455-2: Check prices <https://pricing.snapeda.com/parts/640455-2/TE%20Connectivity/view-part?ref=eda>; AVAILABILITY: In Stock; COMMENT: 640455-2; DESCRIPTION: MTA-100 2 Position 2.54 mm Single Row Right Angle Wire to Board Header; EU_ROHS_COMPLIANCE: Compliant; MF: TE Connectivity; MP: 640455-2; PACKAGE: None; PRICE: None; PURCHASE-URL: https://pricing.snapeda.com/search/part/640455-2/?ref=eda
J8 = SamacSys_Parts:929850-01-06-RB: Headers & Wire Housings 6P STRT BRD MNT SKT 1 ROW 30MICRO" AU Source: Datasheet <https://www.mouser.fr/datasheet/2/1/ts0815-31700.pdf>; DESCRIPTION: Headers & Wire Housings 6P STRT BRD MNT SKT 1 ROW 30MICRO" AU; HEIGHT: 8.26mm; MANUFACTURER_NAME: 3M; MANUFACTURER_PART_NUMBER: 929850-01-06-RB; MOUSER_PART_NUMBER: 517-929850-01-06-RB; MOUSER_PRICE-STOCK: https://www.mouser.co.uk/ProductDetail/3M-Electronic-Solutions-Division/929850-01-06-RB?qs=s3by4FhMkp1OostaNDHGSw%3D%3D
J9 = 61201421721:61201421721: WR-BHD 2.54mm Male Angled Box Header, 14 Pins=>Code : Con_WTB_BHD_2.54_Male_THT_WS_61201421721 <http://katalog.we-online.de/media/thumbs2/eican/thb_Con_WTB_BHD_2.54_Male_THT_WS_6120xx21721_pf2.jpg> Details see: http://katalog.we-online.de/en/em/612_0xx_217_21 Created 2014-06-05, Karrer Zheng 2014 (C) Würth Elektronik Check prices <https://pricing.snapeda.com/parts/61201421721/W%C3%BCrth%20Elektronik/view-part?ref=eda>; AVAILABILITY: In Stock; DESCRIPTION: Connector Header Through Hole, Right Angle 14 position 0.100 (2.54mm); MF: Würth Elektronik; MP: 61201421721; PACKAGE: None; PRICE: None
R1-R19 = rcl:R-EU_: RESISTOR, European symbol
TS53YL104MR1 TS53YL104MR10 = SamacSys_Parts:TS53YL203MR10: Vishay TS53YL Series SMD Trimmer Resistor with Gull Wing Terminations, 20k +/-20% 1/4W +/-100ppm/C Top Adjust Source: Datasheet <https://componentsearchengine.com/Datasheets/1/TS53YL203MR10.pdf>; DESCRIPTION: Vishay TS53YL Series SMD Trimmer Resistor with Gull Wing Terminations, 20k +/-20% 1/4W +/-100ppm/C Top Adjust; HEIGHT: 2.7mm; MANUFACTURER_NAME: Vishay; MANUFACTURER_PART_NUMBER: TS53YL203MR10; MOUSER_PART_NUMBER: 72-TS53YL-20K; MOUSER_PRICE-STOCK: https://www.mouser.com/Search/Refine.aspx?Keyword=72-TS53YL-20K
U1 = MAX889RESA:MAX889RESA: Check prices <https://pricing.snapeda.com/parts/MAX889RESA%2B/Maxim%20Integrated/view-part?ref=eda>; AVAILABILITY: In Stock; DESCRIPTION: Charge Pump Switching Regulator IC Negative Adjustable -2.5V 1 Output 200mA 8-SOIC (0.154, 3.90mm Width); MF: Maxim Integrated; MP: MAX889RESA+; PACKAGE: SOIC-8 Maxim; PRICE: None

## Board
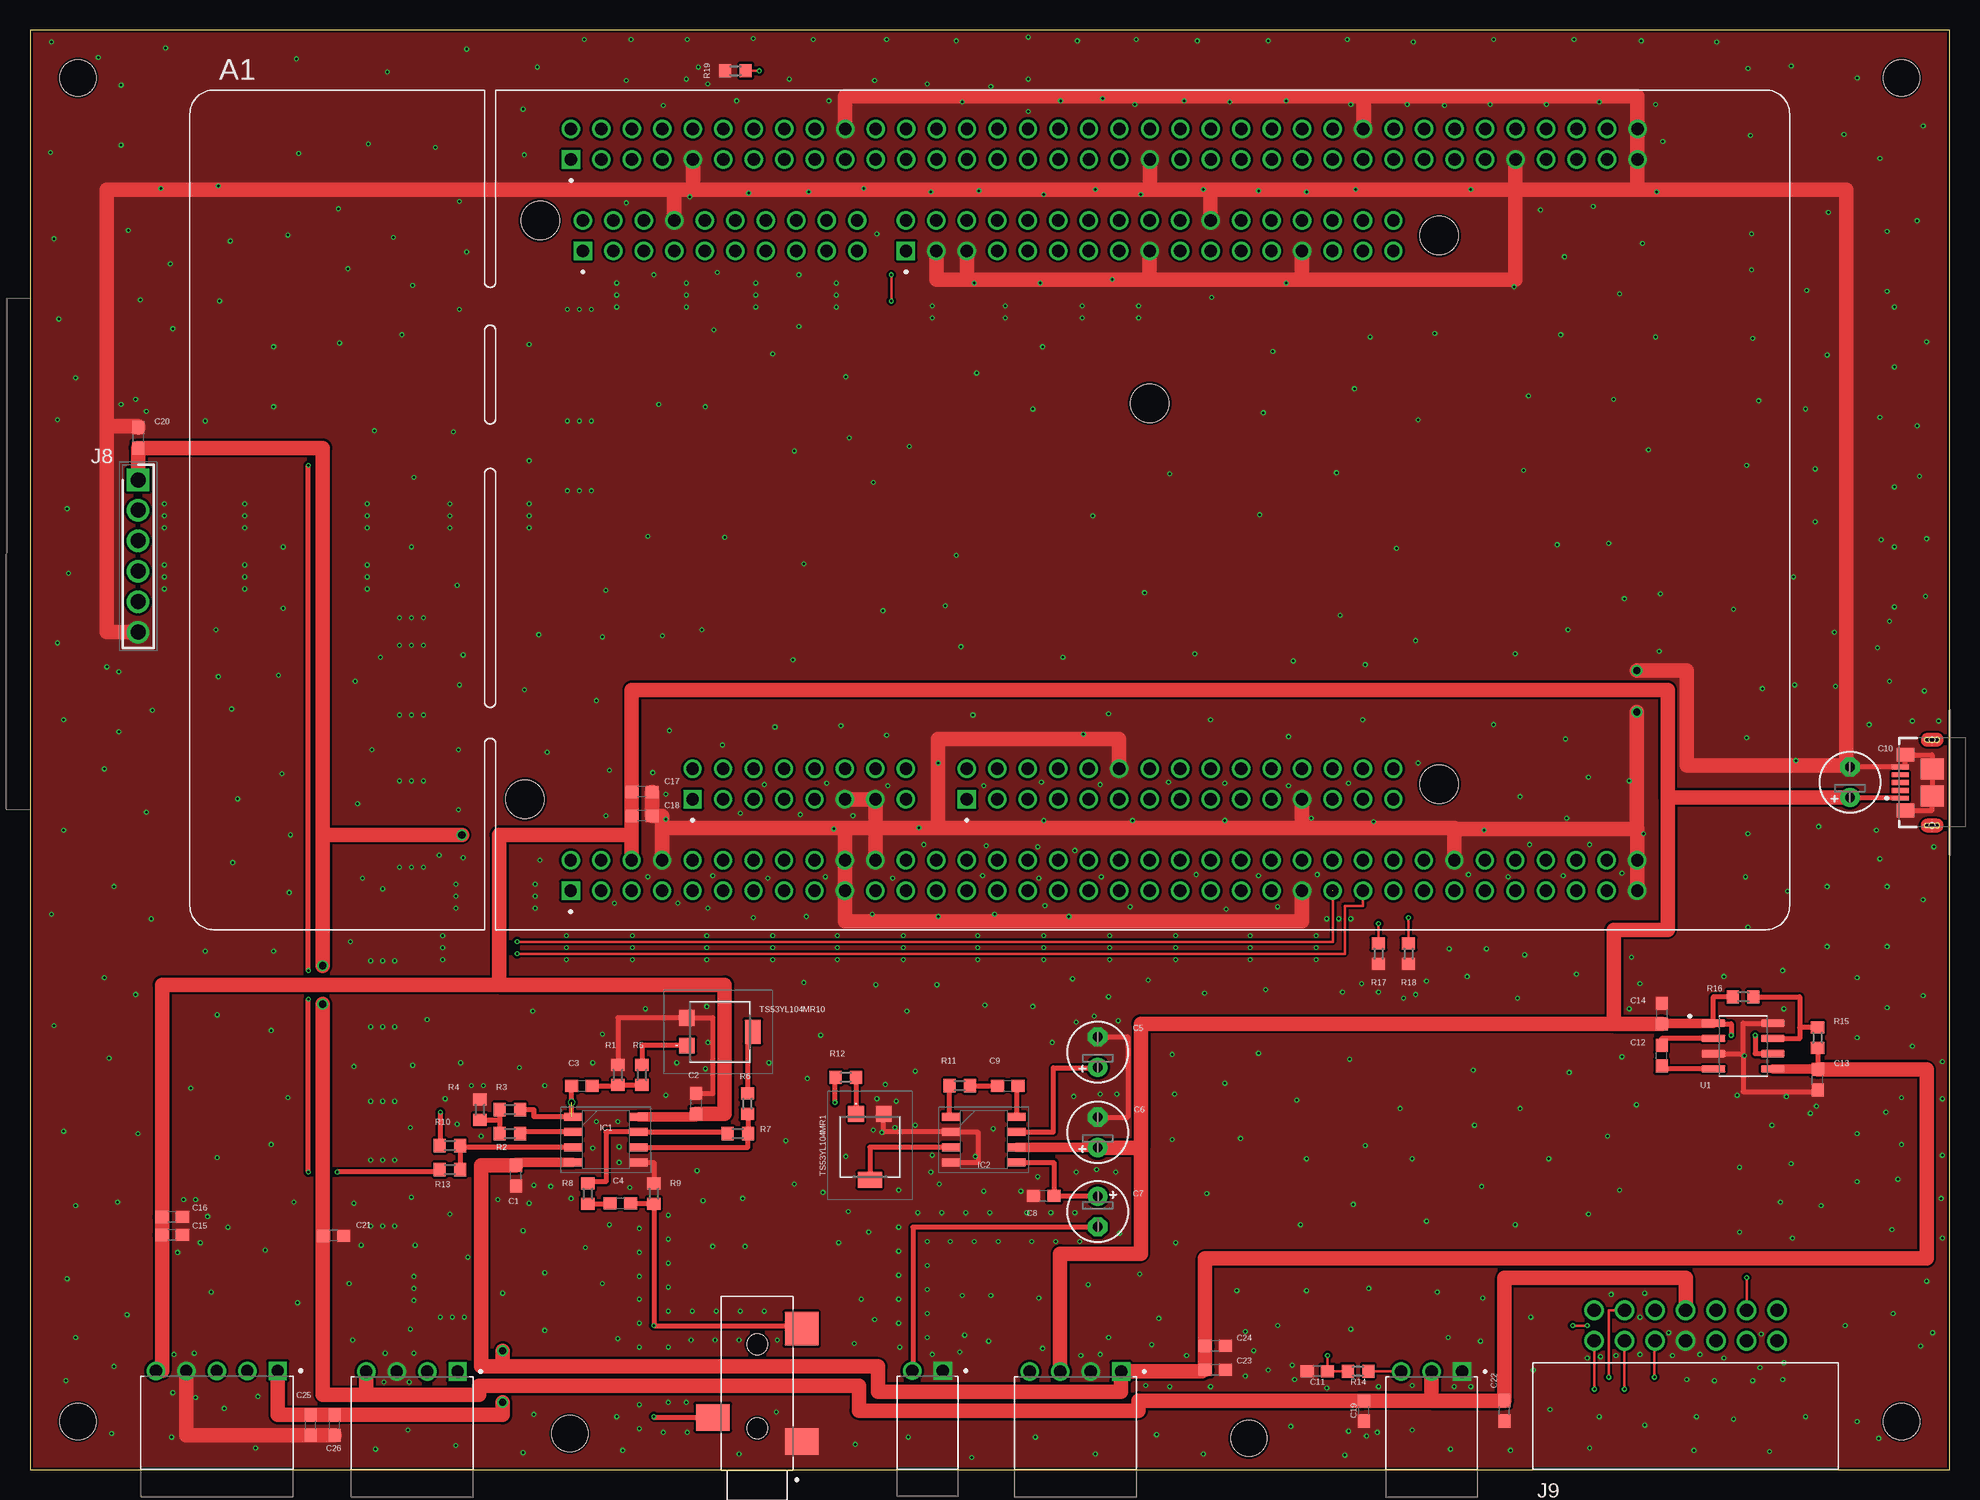
[diagram p4: board, top side]
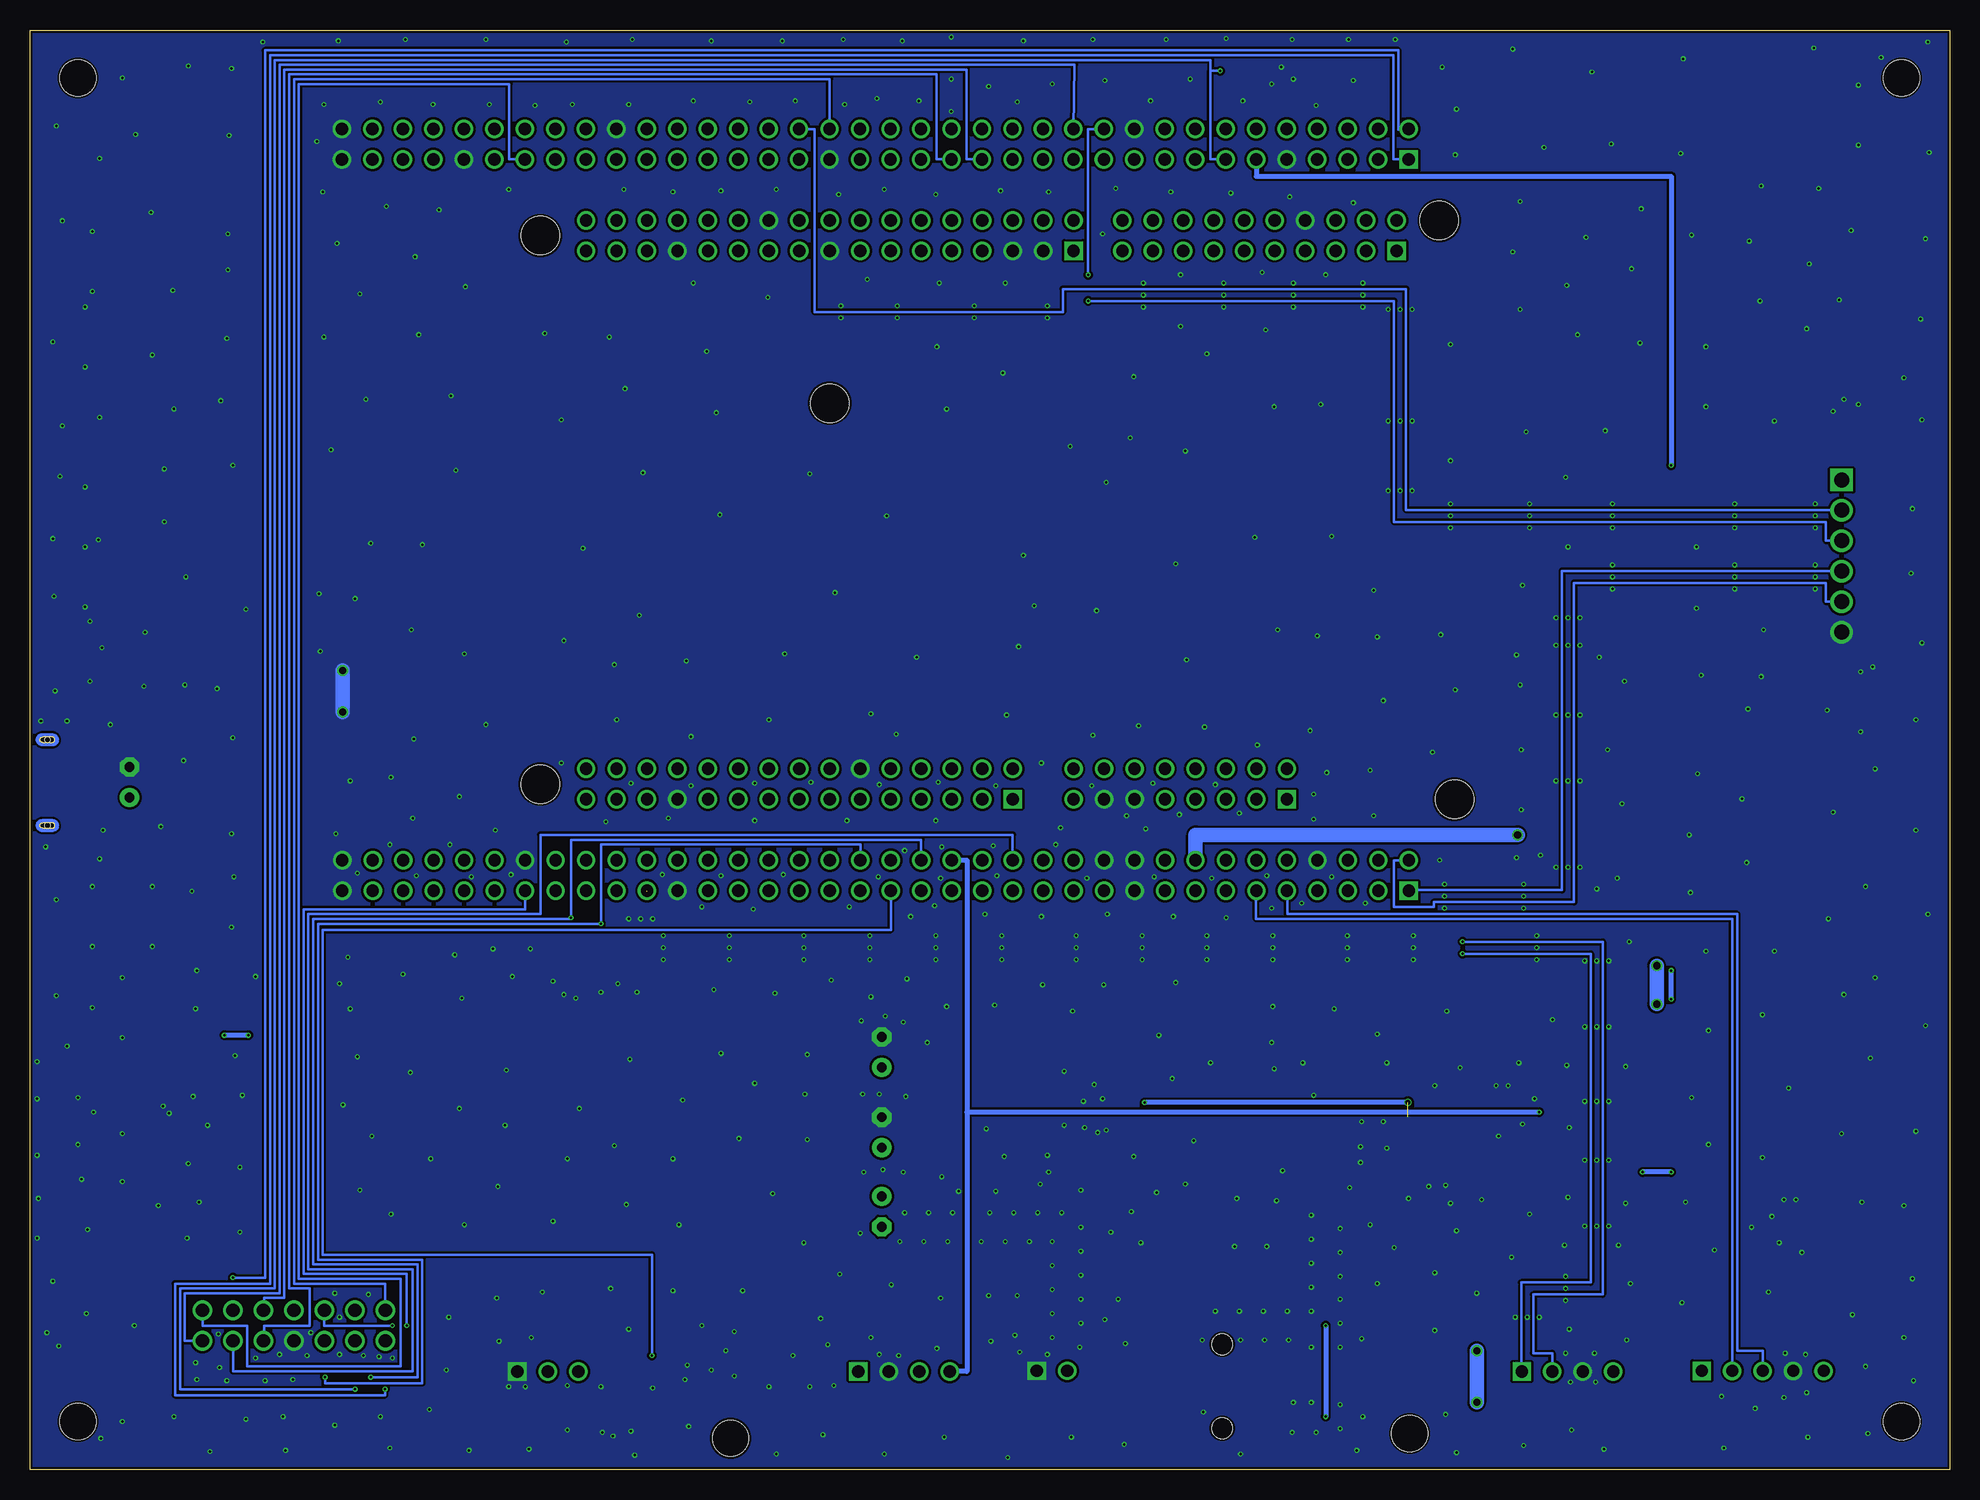
[diagram p5: board, bottom side, seen from below]

Size 160 x 120 mm. Coordinates in mm from the lower left corner, seen from the top.
Outline: 160,0 160,120 0,120 0,0 160,0
Copper layers (1*16): Top 0.018mm / dielectric 1.55mm / Bottom 0.018mm
Design rules "Multi-CB_2L_100µm-Tracks_OL35µm *": minimum track width 0.2mm, minimum drill 0.2mm, track to track 0.2mm, track to pad 0.2mm, pad to pad 0.2mm, via to via 0.2mm, smd to smd 0mil, copper to edge 0.2mm, drill to drill 0.2mm, minimum pad ring 0.125mm, minimum via ring 0.1mm, stop-mask expansion 2mil, vias tented up to drill 0.45mm, thermal gap 0.2mm
Holes 3 mm at 4,116 4,4 156,4 156,116 45,3 101.6,2.6

### Footprints (pad centres in the part's own frame; a part is rotated, then mirrored left to right if it is on the bottom)
MODULE_NUCLEO-F746ZG = drill 1.02 square: CN7_1 21.59,33.914; CN8_1 -24.13,24.77; CN9_1 -24.13,1.91; CN10_1 21.59,6.99; CN11_1 -31.75,34.93; CN12_1 29.21,34.91 | drill 1.02: CN7_2 24.13,33.914; CN7_3 21.59,31.374; CN7_4 24.13,31.374; CN7_5 21.59,28.834; CN7_6 24.13,28.834; CN7_7 21.59,26.294; CN7_8 24.13,26.294; CN7_9 21.59,23.754; CN7_10 24.13,23.754; CN7_11 21.59,21.214; CN7_12 24.13,21.214; CN7_13 21.59,18.674; CN7_14 24.13,18.674; CN7_15 21.59,16.134; CN7_16 24.13,16.134; CN7_17 21.59,13.594; CN7_18 24.13,13.594; CN7_19 21.59,11.054; CN7_20 24.13,11.054; CN8_2 -21.59,24.77; CN8_3 -24.13,22.23; CN8_4 -21.59,22.23; CN8_5 -24.13,19.69; CN8_6 -21.59,19.69; CN8_7 -24.13,17.15; CN8_8 -21.59,17.15; CN8_9 -24.13,14.61; CN8_10 -21.59,14.61; CN8_11 -24.13,12.07; CN8_12 -21.59,12.07; CN8_13 -24.13,9.53; CN8_14 -21.59,9.53; CN8_15 -24.13,6.99; CN8_16 -21.59,6.99; CN9_2 -21.59,1.91; CN9_3 -24.13,-0.63; CN9_4 -21.59,-0.63; CN9_5 -24.13,-3.17; CN9_6 -21.59,-3.17; CN9_7 -24.13,-5.71; CN9_8 -21.59,-5.71; CN9_9 -24.13,-8.25; CN9_10 -21.59,-8.25; CN9_11 -24.13,-10.79; CN9_12 -21.59,-10.79; CN9_13 -24.13,-13.33; CN9_14 -21.59,-13.33; CN9_15 -24.13,-15.87; CN9_16 -21.59,-15.87; CN9_17 -24.13,-18.41; CN9_18 -21.59,-18.41; CN9_19 -24.13,-20.95; CN9_20 -21.59,-20.95; CN9_21 -24.13,-23.49; CN9_22 -21.59,-23.49; CN9_23 -24.13,-26.03; CN9_24 -21.59,-26.03; CN9_25 -24.13,-28.57; CN9_26 -21.59,-28.57; CN9_27 -24.13,-31.11; CN9_28 -21.59,-31.11; CN9_29 -24.13,-33.65; CN9_30 -21.59,-33.65; CN10_2 24.13,6.99; CN10_3 21.59,4.45; CN10_4 24.13,4.45; CN10_5 21.59,1.91; CN10_6 24.13,1.91; CN10_7 21.59,-0.63; CN10_8 24.13,-0.63; CN10_9 21.59,-3.17; CN10_10 24.13,-3.17; CN10_11 21.59,-5.71; CN10_12 24.13,-5.71; CN10_13 21.59,-8.25; CN10_14 24.13,-8.25; CN10_15 21.59,-10.79; CN10_16 24.13,-10.79; CN10_17 21.59,-13.33; CN10_18 24.13,-13.33; CN10_19 21.59,-15.87; CN10_20 24.13,-15.87; CN10_21 21.59,-18.41; CN10_22 24.13,-18.41; CN10_23 21.59,-20.95; CN10_24 24.13,-20.95; CN10_25 21.59,-23.49; CN10_26 24.13,-23.49; CN10_27 21.59,-26.03; CN10_28 24.13,-26.03; CN10_29 21.59,-28.57; CN10_30 24.13,-28.57; CN10_31 21.59,-31.11; CN10_32 24.13,-31.11; CN10_33 21.59,-33.65; CN10_34 24.13,-33.65; CN11_2 -29.21,34.93; CN11_3 -31.75,32.39; CN11_4 -29.21,32.39; CN11_5 -31.75,29.85; CN11_6 -29.21,29.85; CN11_7 -31.75,27.31; CN11_8 -29.21,27.31; CN11_9 -31.75,24.77; CN11_10 -29.21,24.77; CN11_11 -31.75,22.23; CN11_12 -29.21,22.23; CN11_13 -31.75,19.69; CN11_14 -29.21,19.69; CN11_15 -31.75,17.15; CN11_16 -29.21,17.15; CN11_17 -31.75,14.61; CN11_18 -29.21,14.61; CN11_19 -31.75,12.07; CN11_20 -29.21,12.07; CN11_21 -31.75,9.53; CN11_22 -29.21,9.53; CN11_23 -31.75,6.99; CN11_24 -29.21,6.99; CN11_25 -31.75,4.45; CN11_26 -29.21,4.45; CN11_27 -31.75,1.91; CN11_28 -29.21,1.91; CN11_29 -31.75,-0.63; CN11_30 -29.21,-0.63; CN11_31 -31.75,-3.17; CN11_32 -29.21,-3.17; CN11_33 -31.75,-5.71; CN11_34 -29.21,-5.71; CN11_35 -31.75,-8.25; CN11_36 -29.21,-8.25; CN11_37 -31.75,-10.79; CN11_38 -29.21,-10.79; CN11_39 -31.75,-13.33; CN11_40 -29.21,-13.33; CN11_41 -31.75,-15.87; CN11_42 -29.21,-15.87; CN11_43 -31.75,-18.41; CN11_44 -29.21,-18.41; CN11_45 -31.75,-20.95; CN11_46 -29.21,-20.95; CN11_47 -31.75,-23.49; CN11_48 -29.21,-23.49; CN11_49 -31.75,-26.03; CN11_50 -29.21,-26.03; CN11_51 -31.75,-28.57; CN11_52 -29.21,-28.57; CN11_53 -31.75,-31.11; CN11_54 -29.21,-31.11; CN11_55 -31.75,-33.65; CN11_56 -29.21,-33.65; CN11_57 -31.75,-36.19; CN11_58 -29.21,-36.19; CN11_59 -31.75,-38.73; CN11_60 -29.21,-38.73; CN11_61 -31.75,-41.27; CN11_62 -29.21,-41.27; CN11_63 -31.75,-43.81; CN11_64 -29.21,-43.81; CN11_65 -31.75,-46.35; CN11_66 -29.21,-46.35; CN11_67 -31.75,-48.89; CN11_68 -29.21,-48.89; CN11_69 -31.75,-51.43; CN11_70 -29.21,-51.43; CN11_71 -31.75,-53.97; CN11_72 -29.21,-53.97; CN12_2 31.75,34.91; CN12_3 29.21,32.37; CN12_4 31.75,32.37; CN12_5 29.21,29.83; CN12_6 31.75,29.83; CN12_7 29.21,27.29; CN12_8 31.75,27.29; CN12_9 29.21,24.75; CN12_10 31.75,24.75; CN12_11 29.21,22.21; CN12_12 31.75,22.21; CN12_13 29.21,19.67; CN12_14 31.75,19.67; CN12_15 29.21,17.13; CN12_16 31.75,17.13; CN12_17 29.21,14.59; CN12_18 31.75,14.59; CN12_19 29.21,12.05; CN12_20 31.75,12.05; CN12_21 29.21,9.51; CN12_22 31.75,9.51; CN12_23 29.21,6.97; CN12_24 31.75,6.97; CN12_25 29.21,4.43; CN12_26 31.75,4.43; CN12_27 29.21,1.89; CN12_28 31.75,1.89; CN12_29 29.21,-0.65; CN12_30 31.75,-0.65; CN12_31 29.21,-3.19; CN12_32 31.75,-3.19; CN12_33 29.21,-5.73; CN12_34 31.75,-5.73; CN12_35 29.21,-8.27; CN12_36 31.75,-8.27; CN12_37 29.21,-10.81; CN12_38 31.75,-10.81; CN12_39 29.21,-13.35; CN12_40 31.75,-13.35; CN12_41 29.21,-15.89; CN12_42 31.75,-15.89; CN12_43 29.21,-18.43; CN12_44 31.75,-18.43; CN12_45 29.21,-20.97; CN12_46 31.75,-20.97; CN12_47 29.21,-23.51; CN12_48 31.75,-23.51; CN12_49 29.21,-26.05; CN12_50 31.75,-26.05; CN12_51 29.21,-28.59; CN12_52 31.75,-28.59; CN12_53 29.21,-31.13; CN12_54 31.75,-31.13; CN12_55 29.21,-33.67; CN12_56 31.75,-33.67; CN12_57 29.21,-36.21; CN12_58 31.75,-36.21; CN12_59 29.21,-38.75; CN12_60 31.75,-38.75; CN12_61 29.21,-41.29; CN12_62 31.75,-41.29; CN12_63 29.21,-43.83; CN12_64 31.75,-43.83; CN12_65 29.21,-46.37; CN12_66 31.75,-46.37; CN12_67 29.21,-48.91; CN12_68 31.75,-48.91; CN12_69 29.21,-51.45; CN12_70 31.75,-51.45; CN12_71 29.21,-53.99; CN12_72 31.75,-53.99 | hole 3.2: -22.86,-37.46; 22.86,-37.46; 24.13,37.47; 8.89,-13.33; -24.13,38.74
C0603 = smd 1.1 x 1: 1 -0.85,0; 2 0.85,0
E2,5-5 = drill 0.813 pad 1.6: + -1.27,0 | drill 0.813 pad 1.6 octagon: - 1.27,0
SOIC127P600X175-8N = smd 1.528 x 0.65: 1 -2.711,1.905; 2 -2.711,0.635; 3 -2.711,-0.635; 4 -2.711,-1.905; 5 2.711,-1.905; 6 2.711,-0.635; 7 2.711,0.635; 8 2.711,1.905
GCT_USB3076-XX-X_REVC = smd 0.4 x 1.4: 1 -1.3,2.65; 2 -0.65,2.65; 3 0,2.65; 4 0.66,2.65; 5 1.3,2.65 | smd 0.1 x 0.1: 6 -3.549,0.73; 7 3.601,0.73 | smd 1.15 x 1.45: 8 -2.32,2.23; 9 2.32,2.23 | smd 1.75 x 1.9: 10 -1.125,0; 11 1.125,0 | hole 0.45: -3.575,0; 3.575,0
TE_640455-5 = drill 1.02 pad 1.37 square: 1 0,0 | drill 1.02 pad 1.37: 2 -2.54,0; 3 -5.08,0; 4 -7.62,0; 5 -10.16,0
TE_640455-3 = drill 1.02 pad 1.37 square: 1 0,0 | drill 1.02 pad 1.37: 2 -2.54,0; 3 -5.08,0
TE_640455-4 = drill 1.02 pad 1.37 square: 1 0,0 | drill 1.02 pad 1.37: 2 -2.54,0; 3 -5.08,0; 4 -7.62,0
CUI_SJ-3523-SMT-TR = smd 2.2 x 2.8: 1 -1.1,-3.7; 3 0.9,3.7 | smd 2.8 x 2.8: 2 8.3,-3.7 | hole 1.7: 0,0; 7,0
TE_640455-2 = drill 1.02 pad 1.37 square: 1 0,0 | drill 1.02 pad 1.37: 2 -2.54,0
RHDR6W76P0X254_1X6_1524X254X82 = drill 1.25 pad 1.875 square: 1 0,0 | drill 1.25 pad 1.875: 2 2.54,0; 3 5.08,0; 4 7.62,0; 5 10.16,0; 6 12.7,0
61201421721 = drill 1.1: 1 7.62,-1.27; 2 7.62,1.27; 3 5.08,-1.27; 4 5.08,1.27; 5 2.54,-1.27; 6 2.54,1.27; 7 0,-1.27; 8 0,1.27; 9 -2.54,-1.27; 10 -2.54,1.27; 11 -5.08,-1.27; 12 -5.08,1.27; 13 -7.62,-1.27; 14 -7.62,1.27
R0603 = smd 1 x 1.1: 1 -0.85,0; 2 0.85,0
TS53YL203MR10 = smd 1.3 x 1.3: 1 1.15,-2.75; 3 -1.15,-2.75 | smd 2 x 1.3: 2 0,2.75
SOIC127P600X175-8N' = smd 1.97 x 0.59: 1 -2.475,1.905; 2 -2.475,0.635; 3 -2.475,-0.635; 4 -2.475,-1.905; 5 2.475,-1.905; 6 2.475,-0.635; 7 2.475,0.635; 8 2.475,1.905

### Placement (x,y rotation side)
A1  80,80 90 top
C1  40.5,24.5 90 top
C2  55.5,30.5 270 top
C3  46,32 0 top
C4  49.2,22.2 0 top
C5  89,34.8 90 top
C6  89,28.1 90 top
C7  89,21.5 270 top
C8  84.5,22.8 180 top
C9  81.5,32 0 top
C10  151.7,57.3 90 top
C11  107.3,8.2 180 top
C12  136,34.5 90 top
C13  149,32.5 90 top
C14  136,38 270 top
C15  11.85,19.55 180 top
C16  11.85,21.05 180 top
C17  51,56.5 180 top
C18  51,54.5 180 top
C19  111.2,4.9 90 top
C20  9,86 270 top
C21  25.3,19.5 180 top
C22  122.9,4.9 90 top
C23  98.8,8.3 180 top
C24  98.8,10.3 180 top
C25  23.4,3.7 90 top
C26  25.4,3.7 90 top
IC1  48,27.5 0 top
IC2  79.5,27.5 0 top
J1  158.55,57.26 90 top
J2  20.65,8.22 0 top
J3  119.37,8.17 0 top
J4  90.95,8.17 0 top
J5  35.65,8.17 0 top
J6  60.62,3.44 90 top
J7  76.08,8.23 0 top
J8  9,82.5 270 top
J9  138,12 0 top
R1  49,32.9 270 top
R2  40,28 180 top
R3  40,30 180 top
R4  37.5,30 90 top
R5  51,32.9 90 top
R6  59.8,30.5 270 top
R7  59,28 180 top
R8  46.5,23 270 top
R9  52,23 270 top
R10  35,27 0 top
R11  77.5,32 0 top
R12  68,32.7 0 top
R13  35,25 0 top
R14  110.7,8.2 180 top
R15  149,36 270 top
R16  142.8,39.4 0 top
R17  112.4,43 90 top
R18  114.9,43 90 top
R19  58.8,116.6 0 top
TS53YL104MR1  70,26.9 180 top
TS53YL104MR10  57.5,36.5 270 top
U1  MAX889RESA  [SOIC127P600X175-8N']  142.8,35.3 0 top

### Tracks (layer width: path | path; a pad name or v marks a point on that pad's centre or on a via)
1_IN+
  Top 0.4: IC1.3 35.85,26.86 | 35.85,26.86 R10.2 | 35.85,26.86 R13.2
1_IN-
  Top 0.4: IC1.2 40.85,28.14 R2.1
1_OUT  (via drill 0.2, 0.4)  (1 unrouted)
  Top 0.4: R3.1 42,30 42,29.41 IC1.1 45.15,29.41 C3.1 45.15,32.1 | v67.1,30.6 67.1,32.7 R12.1
  Bottom 0.4: v45.15,30.6 v67.1,30.6
2_IN-
  Top 0.4: R6.2 59.85,29.65 R7.1 59.85,26.86 IC1.6
2_OUT
  Top 0.4: R7.2 58.15,28.14 IC1.7 48,28.14 48,24 46.5,24 R8.1
+3V3  (via drill 0.6)
  Top 0.2: C21.2 24.45,18.5 24.4,18.5
  Top 1.2: 28.03,6.25 37.45,6.25 37.45,7 69.1,7 69.1,4.9 92.4,4.9 92.4,5.75 C19.2 116.83,5.75 | J3.2 116.83,5.75 | 116.83,5.75 C22.2 122.9,16 138,16 J9.8 | 24.4,52.9 24.4,85.15 C20.2 J8.1 | v36,52.9 24.4,52.9 | 24.4,52.9 v24.4,42 | J5.4 28.03,6.25 | v24.4,38.8 24.4,18.5 24.4,6.25 28.03,6.25
  Bottom 1.2: A1.CN11_16 62.85,52.9 v36,52.9 | v24.4,42 v24.4,38.8
+5V  (via drill 0.2 pad 0.4)
  Top 0.4: v141.8,36.2 141.8,37.15 140.32,37.15 U1.1 140.32,39.4 R16.1 | v143.8,36.2 143.8,34.66 U1.6 | 55.5,29.41 C2.2 | J1.1 150.4,55.96
  Top 0.406: 150.4,55.96 C10.+
  Top 0.8: IC1.8 55.5,29.41 | IC2.6 89,26.86 C6.+ | U1.1 136,37.2 C14.2
  Top 1.2: C10.+ 136.5,56.03 | 136.5,56.03 136.5,65 50.15,65 C17.2 C18.2 A1.CN11_6 50.15,52.9 39.1,52.9 39.1,40.4 | 136.5,56.03 136.5,45 132,45 132,37.15 | 132,37.15 92.6,37.15 92.6,26.8 | 92.6,26.8 89,26.8 C6.+ | 132,37.15 C14.2 | J4.3 85.87,18 92.6,18 92.6,26.8 | 39.1,40.4 57.9,40.4 57.9,29.65 C2.2 | 39.1,40.4 11,40.4 C16.2 C15.2 11,8.22 J2.5
  Bottom 0.4: v141.8,36.2 v143.8,36.2
-5V  (via drill 0.6)
  Top 0.4: R15.2 149,33.4 C13.2 | 40.5,25.59 C1.2
  Top 0.8: IC1.4 40.5,25.59 | 97.7,8.17 97.7,8.3 C23.2 | U1.5 155,33.4 149,33.4
  Top 1.2: 97.7,8.17 J4.1 90.95,6.5 70.7,6.5 70.7,8.6 39.4,8.6 | C1.2 37.6,25.35 37.6,8.6 39.4,8.6 | C23.2 C24.2 97.95,17.6 158.1,17.6 158.1,33.35 C13.2 | J2.1 20.65,4.55 C25.2 C26.2 39.4,4.55 v39.4,5.6 | 39.4,8.6 v39.4,9.9
  Bottom 1.2: v39.4,9.9 v39.4,5.6
ADC_EMG_AC
  Bottom 0.2: J2.2 18.11,45.9 57.8,45.9 57.8,48.25 A1.CN11_11
ADC_EMG_DC
  Bottom 0.2: J2.3 15.57,9.9 17.7,9.9 17.7,46.3 55.2,46.3 55.2,48.25 A1.CN11_9
ADC_JOYSTICK_VRX  (via drill 0.2)
  Top 0.2: v132.9,6.7 132.9,10.73 J9.11 | v60.8,116.6 R19.2
  Bottom 0.2: A1.CN12_13 61.6,109.21 61.6,116.6 | v132.9,6.7 147.5,6.7 147.5,15.1 139.6,15.1 139.6,117.5 61.6,117.5 61.6,116.6 | 61.6,116.6 v60.8,116.6
ADC_JOYSTICK_VRY  (via drill 0.2)
  Top 0.2: v131.6,7.7 131.6,13.27 J9.12 | v114.9,46 R18.2
  Bottom 0.2: A1.CN11_34 85.71,52.5 114.9,52.5 v114.9,46 114.9,45.9 136.4,45.9 136.4,17.1 127.7,17.1 127.7,7.7 v131.6,7.7
ADC_KEYS  (via drill 0.2)
  Top 0.2: R14.2 C11.1 v108.15,9.5
  Bottom 0.2: v108.15,9.5 108.15,17.9 135.6,17.9 135.6,45 88.25,45 A1.CN11_35
ADC_POTI  (via drill 0.2)
  Top 0.2: v135.4,7.7 135.4,10.73 J9.9 | v112.4,45.5 R17.2
  Bottom 0.2: A1.CN11_38 90.79,52.1 112.4,52.1 v112.4,45.5 136,45.5 136,17.5 127.3,17.5 127.3,7.2 135.4,7.2 v135.4,7.7
BUTTON_BACK  (via drill 0.2)
  Top 0.2: v130.4,6.7 130.4,10.73 J9.13
  Bottom 0.2: A1.CN12_1 46.35,109.21 46.35,117.9 140,117.9 140,15.5 147.9,15.5 147.9,6.2 130.4,6.2 v130.4,6.7
BUTTON_ENTER
  Bottom 0.2: A1.CN12_40 93.35,115.9 138,115.9 138,15.5 130.4,15.5 130.4,13.27 J9.14
DAC_OUT1  (via drill 0.2)
  Top 0.2: 34.2,27 R10.1
  Top 0.4: v34.2,29.8 34.2,27
  Bottom 0.2: A1.CN11_32
  Bottom 0.4: A1.CN11_32 81.9,50.8 81.9,29.8 | 81.9,29.8 v34.2,29.8 | 81.9,29.8 81.9,8.17 J4.4
DAC_OUT2  (via drill 0.2)
  Top 0.4: R13.1 34.15,24.8 v25.6,24.8 | v23.2,24.8 v23.2,39.2 | v23.2,41.6 v23.2,83.7
  Bottom 0.4: A1.CN12_11 57.79,107.8 23.2,107.8 v23.2,83.7 | v23.2,24.8 v25.6,24.8 | v23.2,39.2 v23.2,41.6
DISP_BUSY
  Bottom 0.2: A1.CN12_24 72.93,117.1 139.2,117.1 139.2,14.7 147.1,14.7 147.1,10.73 J9.1
DISP_CLK
  Bottom 0.2: A1.CN12_31 84.45,109.21 84.45,116.3 138.4,116.3 138.4,15.1 136.7,15.1 136.7,12 140.5,12 140.5,10.73 J9.5
DISP_CS  (via drill 0.2)
  Top 0.2: v143.1,16 143.1,13.27 J9.4
  Bottom 0.2: A1.CN12_2 45.09,111.7 45.95,111.7 45.94,118.3 140.4,118.3 140.4,16 v143.1,16
DISP_DC
  Bottom 0.2: A1.CN11_28 78.09,52.9 117.45,52.9 117.45,46.3 136.8,46.3 136.8,16.7 128.1,16.7 128.1,8.2 143.08,8.2 J9.3
DISP_DIN
  Bottom 0.2: A1.CN12_29 81.95,109.21 81.95,116.7 138.8,116.7 138.8,14.3 140.5,14.3 140.5,13.27 J9.6
DISP_RST
  Bottom 0.2: A1.CN12_59 120.05,109.21 120.05,115.5 137.6,115.5 137.6,15.9 129.1,15.9 129.1,8.6 141.9,8.6 141.9,12 145.6,12 145.6,13.27 J9.2
GND  (via drill 0.2, 0.6)
  Top 0.4: 142.8,34.66 142.8,37.2 U1.8 | U1.3 142.8,34.66 | 142.8,34.66 142.8,31.5 149,31.5 C13.1 | IC2.4 79,25.59 79,28.14 IC2.2 71.15,28.14 TS53YL104MR1.3 | C5.- 91.5,36.07 91.5,29.37 C6.- | C2.1 56.9,31.35 56.9,37.65 TS53YL104MR10.3 49,37.65 R1.1 | IC1.5 52,25.59 R9.1 | J1.5 151.4,58.56
  Top 0.406: J1.5 156.32,58.56 J1.9 158.55,59.58 J1.11 J1.10 158.55,54.94 J1.8
  Top 1.2: A1.CN8_11 A1.CN8_13 70.47,53.5 | 70.47,53.5 A1.CN11_22 | 52.69,53.5 52.69,54.5 C18.1 C17.1 | A1.CN11_8 52.69,53.5 | 52.69,53.5 67.93,53.5 | A1.CN9_23 106.03,53.5 | 106.03,53.5 118.73,53.5 A1.CN11_60 118.73,53.4 133.95,53.4 | 133.95,53.4 133.97,53.45 A1.CN11_72 A1.CN11_71 | 55.25,106.7 53.71,106.7 | A1.CN7_8 53.71,106.7 | A1.CN12_39 93.35,106.7 | 93.35,106.7 98.41,106.7 | A1.CN10_22 98.41,106.7 | 98.41,106.7 123.83,106.7 | 133.99,106.7 A1.CN12_71 A1.CN12_72 133.99,114.5 111.13,114.5 A1.CN12_54 111.2,111.75 111.2,114.5 67.95,114.5 A1.CN12_20 | 133.99,106.7 123.83,106.7 | A1.CN12_63 123.83,106.7 | 93.33,99.2 106.03,99.2 | A1.CN10_27 106.03,99.2 | A1.CN10_3 75.55,99.2 78.09,99.2 | 78.09,99.2 93.33,99.2 | A1.CN10_5 78.09,99.2 | A1.CN12_9 55.25,106.7 | 55.25,106.7 93.35,106.7 | 151.4,58.7 C10.- 151.4,58.56 | 151.4,58.7 151.4,106.7 133.99,106.7 | J8.6 6.4,69.8 6.4,87 | 6.4,87 6.4,106.7 53.71,106.7 | C20.1 9,87 6.4,87 | 151.4,58.7 138.1,58.7 138.1,66.6 v133.95,66.6 | A1.CN10_17 93.33,99.2 | 106.03,99.2 123.83,99.2 123.83,106.7 | 106.03,53.5 75.7,53.5 | 75.7,53.5 70.47,53.5 | 67.93,53.5 A1.CN11_20 A1.CN11_19 67.93,45.7 106.03,45.7 A1.CN11_49 | 67.93,53.5 70.47,53.5 | A1.CN9_12 90.79,60.9 75.7,60.9 75.7,53.5 | 133.95,53.4 v133.95,63.15 | J2.4 13.03,2.85 C25.1 C26.1
  Bottom 1.2: v133.95,63.15 v133.95,66.6
  other vias: 109.1,45.9 107.2,43.5 107.2,44.5 107.2,42.5 108.1,45.9 110.1,45.9 11.2,74.4 11.2,73.4 11.2,75.4 17.9,74.4 17.9,73.4 17.9,75.4 28.1,74.4 28.1,73.4 28.1,75.4 35.5,47.8 35.5,46.8 35.5,48.8 42.1,47.8 42.1,46.8 42.1,48.8 31.8,71 30.8,71 32.8,71 31.8,68.7 30.8,68.7 32.8,68.7 31.8,62.9 30.8,62.9 32.8,62.9 31.8,57.4 30.8,57.4 32.8,57.4 35.2,12.7 34.2,12.7 36.2,12.7 32,15.1 32,14.1 32,16.1 29.4,20.3 28.4,20.3 30.4,20.3 29.4,25.8 30.4,25.8 28.4,25.8 29.4,30.7 28.4,30.7 30.4,30.7 29.4,36.9 30.4,36.9 28.4,36.9 29.4,42.4 28.4,42.4 30.4,42.4 34.4,43.5 34.4,42.5 34.4,44.5 44.7,43.5 44.7,42.5 44.7,44.5 50.2,43.5 50.2,44.5 50.2,42.5 56.4,43.5 56.4,42.5 56.4,44.5 61.9,43.5 61.9,44.5 61.9,42.5 67.3,43.5 67.3,42.5 67.3,44.5 72.8,43.5 72.8,44.5 72.8,42.5 79,43.5 79,42.5 79,44.5 84.5,43.5 84.5,44.5 84.5,42.5 90,43.5 90,42.5 90,44.5 95.5,43.5 95.5,44.5 95.5,42.5 101.7,43.5 101.7,42.5 101.7,44.5 17.9,79.5 17.9,78.5 17.9,80.5 11.2,79.5 11.2,78.5 11.2,80.5 67.2,97.9 67.2,98.9 67.2,96.9 60.5,97.9 60.5,98.9 60.5,96.9 54.7,97.9 54.7,98.9 54.7,96.9 48.9,97.9 48.9,98.9 48.9,96.9 45.8,96.7 44.8,96.7 46.8,96.7 45.8,87.4 44.8,87.4 46.8,87.4 45.8,81.6 44.8,81.6 46.8,81.6 28.1,79.5 28.1,78.5 28.1,80.5 35,79.5 35,78.5 35,80.5 41.6,79.5 41.6,78.5 41.6,80.5 75.2,97 75.2,96 81.3,97 81.3,96 87.7,97 87.7,96 92.4,97 92.4,96 41.1,19.9 46.3,18.5 42.9,16.4 47.7,15.5 42.9,11.6 49,10.9 43.4,23.6 46.9,26.8 47.2,29 46.9,33.9 53,31.2 53.9,33.9 56.5,35.6 56.4,38.6 51.3,38.4 47.7,36.3 41.9,38.2 42.9,32 40.8,33.5 35.9,33.9 31.9,33.7 31.7,28.5 33.1,37.5 64.8,32.6 31.8,50.2 30.8,50.2 32.8,50.2 31.8,22.7 35,21.3 32.1,18.7 31.7,11.7 26.9,10.8 26.6,15.5 27,22.2 42,4.6 48.9,4.4 35.5,2 28.8,1.7 18.8,1.8 16.2,5.1 11.8,2.7 3.8,11 7,8.6 8.1,12.9 15.1,14.8 22.3,13.9 19.6,18.3 22,22.3 20.1,27.1 21.5,31 20.1,36.6 27,33.6 15.6,37.9 13.4,31.8 15.6,26 16.5,20.2 7.3,22.3 9,28 6.6,34.3 8.8,39.6 1.8,46.3 14.6,43.2 20.3,43.2 26.7,44 7,48.6 2.8,53.3 6.2,58.4 2.8,62.5 6.4,66.9 7.4,66.5 15.5,70 21.1,71.8 20.7,66.2 15.7,66.1 16.8,63.4 21,58 16.9,50.6 27.3,55.5 28.5,60 27.1,65.7 29.2,67.7 21.1,76.9 31.8,76.9 35.6,73.7 36.1,67.9 35.8,65.4 35.7,60 35.7,55 48.3,58.3 43.1,59.8 47.2,64.1 41.2,65 47.7,69.4 42.4,69.6 48,73.3 52.7,69.5 51.5,77.8 52.4,88.8 61.9,93 56.3,88.6 63.7,84.9 68,91.1 78.9,91.4 83.6,88.4 73.3,85.3 64.5,75.5 63.6,67.5 57.9,77.7 71.1,71.6 77.6,68.6 77.2,76.2 88.6,79.5 95,83 102.5,79.6 109.2,71.2 105.3,67.4 97.1,68 86.1,67.7 92.9,73.1 53.3,61.6 62.1,61.9 71.4,61.2 78.6,62.9 87.8,61.3 98.4,62.5 104.9,61.1 111.1,62.5 122,62.1 124.2,56.1 121.2,53.3 75.7,58.9 67,53.4 74.1,53.5 84.5,54.1 91.9,54.1 99.6,54.1 106.8,54.3 112,54 115.7,58.9 27.7,49.3 60.3,46 64.7,46.1 70.2,46.3 75.7,46.1 80.4,46.3 86.6,46.1 85.2,35.6 83.6,38.6 86.9,40.9 89.9,39.4 93.2,40.8 97.9,39.7 103,40 95.2,34.6 95.4,31.3 95.2,27.5 90.6,31.3 87,31.1 87.2,24.8 90.5,24.8 64.5,40.6 70.5,40.4 75.6,40.4 79.6,38.7 73.8,33.2 73.1,38.2 65.9,36.2 61.6,33.9 63,27.4 68,26.1 55.6,24.9 49.1,25.6 48.3,20.4 56.1,22.4 56.9,18.6 57.2,13.2 55.2,13.2 59.2,13.2 68.7,10.5 70.4,12.5 69.3,14.2 67.4,18.9 59.6,18.6 59.4,22.6 63.7,23.8 76,21.4 79.5,23.2 74.8,19 80.1,14.5 77.7,14.5 79.9,10.7 77.9,11.2 87.5,19 84.1,14.3 84.4,10.1 88.2,15.4 92.5,16.3 89.9,11 94.1,12.6 41.1,1.4 49.4,1.6 59.1,1.3 62.2,4.8 68.8,2.1 73.2,2.7 78.5,1 83.8,2.7 88.8,1.3 93.9,2.9 97.8,1.3 105.1,3.6 109.6,1.2 115.2,3.3 118.4,1.7 123.4,1.6 126.7,5 130,1.8 134.6,3.7 138.7,1.6 142,4.2 145,1.5 148,4.4 154.1,2.6 158.6,11.4 155.2,20 157.6,10.3 155.3,13 158.1,15.7 125.3,8.3 125.1,12.7 78.8,26.1 80.3,28.4 69.9,19.8 71.3,32.1 71,28.1 73.8,28.7 72.1,28.5 90.8,19.7 95.5,18.9 100.6,14.9 106.4,14.9 104,12 103.2,8.3 110.1,11.7 111.6,15.1 117.3,14.8 118.2,11 121.1,14.3 120.9,10.7 159.4,19.3 159.3,22.6 159.4,26.2 159.4,30.9 159.4,34 156.9,35.3 157.8,39.5 154.8,38.5 146.2,38.4 142.9,34.5 142.3,31.2 145.2,28.7 142.5,25.2 145.9,22.3 142.5,19.8 146.9,19.3 155.7,24.2 146.8,25.5 156,27.1 148.4,29.7 146.4,31.1 156,31 132.7,34.4 133.9,30.4 131.5,27.8 132.5,23.3 129.9,21.3 123.8,20.4 121,23.6 116.4,20.7 110.3,22.1 105.9,20.4 98.1,23 100.9,27.6 99.6,32.2 105.6,30.8 110,34.2 114.2,30.1 120.3,33.3 124.2,30.1 128.3,33.1 106.4,25.9 115.2,25.9 126.6,25.9 120.4,28.7 109.4,39.8 114.5,39.3 119.8,41.1 124,39.3 128.9,41.3 124.6,42.9 118.3,43.4 134.5,53 128.1,54.3 133.3,57.4 128,60.9 129.9,57.7 123.8,68 115.5,69.1 111.3,67.1 132.9,72.6 127.3,77.1 128.2,70 147.2,59.1 154.8,43.6 157.8,47.5 154.2,50.9 149.1,53.6 143,49.4 146.5,48.2 143.2,45.2 146.1,41.6 141.2,41.1 153.3,62.1 157.9,64.9 154,68.5 158,72.8 154.3,77.5 157.5,82.8 154.2,87.7 158.1,94 154.8,98.2 157.3,104.1 154.2,109.3 157.8,112 146.8,117 143.4,111.2 149.9,104.8 148.1,98.3 149.8,92.9 148.8,83.4 148,88.4 147,74.4 150.4,69.8 147.1,65.4 150.5,65.3 135.8,68.2 135.9,73 131.6,77.2 134.9,85 132,89.2 135.5,94.4 132.5,98 134.4,102.2 130.3,105.3 125.9,105 127.9,101.1 123.7,98.6 127.6,94.6 124.9,89.5 124.5,83.3 113.9,76.8 108.9,83.1 115.7,87.5 110.4,90.1 102.8,88.1 103.6,93.2 111.7,94.4 117.1,94.7 98.5,97.7 104.7,98.9 78.7,98.9 84.2,98.9 90.2,99.2 97.8,106.7 102.4,106.6 110.5,106.7 120.1,106.7 106.4,106.5 92.6,106.3 88.8,106.7 84.5,106.3 79.1,106.6 75.1,106.5 41.6,84.1 41.6,93.8 35.8,96.7 35.3,86.5 32,82.7 28.7,86.6 25.8,93.9 31,94.6 26.5,100.1 25.7,105.1 30.3,102.7 35.8,105.7 31.9,98.7 36.4,101.5 14.6,87.4 20.3,93.6 15.8,97.4 21.5,102.9 15.7,107 22.4,109.7 10.9,106.8 8.2,103.3 11.7,100.5 9.2,97.5 11.9,95.1 7.6,88.8 1.7,109.8 5.7,117.7 7.6,115.4 22.2,117.6 29.8,116.5 36.4,118.4 42.3,116.9 49.7,115.8 52.8,113.7 58.9,114.1 54.7,115.9 41.1,113.4 41.2,109.6 33.8,110.2 28.2,110.5 49.7,105.6 55,106.1 59.9,106.4 64.9,106.5 69.5,106.8 70.6,103 57.3,99.8 52,99.6 64.1,99.6 57,95 64.1,95.3 84.4,93.6 46.2,119.2 50.1,119.2 54.8,119.2 60.3,119.3 65.3,119.2 71.4,119.2 77.2,119.1 83.2,119.4 87.3,119.1 92.2,119.2 97.3,119.1 103.2,119.1 109.8,119.2 115.3,119 122,119.2 128.7,119.2 134.3,119.1 140.6,119 143.2,116.8 135.5,113.8 130.8,114 126.4,113.8 121.7,113.8 136.1,110.7 135.6,106.5 96.2,114.1 100,114 104.7,114.1 110.1,113.8 114.8,113.8 117.9,113.7 85.9,114.1 89.4,114.3 92.1,113.8 74.8,115.5 77.7,114 80.1,115.3 63.3,115.9 66.6,114.1 70.4,115.8 83.2,115.9 83.2,113.2 146.2,8.9 138.1,7.5 140.4,7.4 131.8,14.6 134.6,14.7 134.2,9.6 136.9,9.5 139.2,9.6 132.2,9.5 130.9,9.4 129.8,9.3 141.2,9.3 136.6,11.4 144.2,8.5 130.8,4.4 138.9,4.4 133.5,42.7 134.2,40.5 56,70 70.3,82.3 49.1,26.9 49,29 45.1,22.6 50,23.5 37.6,27.8 35.6,28.8 34.6,30.9 56.3,33.4 42,23.7 39,22.5 27.6,18.7 29.6,9.7 32,9.7 13.7,9.7 11.9,6.4 13.8,6 75.2,9.6 77.5,9.8 87.6,9.5 89.2,9.6 102,9.9 101.3,11.5 101.3,7.8 93,7 95,6.9 98.4,6.9 96.4,9.5 93.5,10.4 105.2,8.7 105.4,7.5 109.9,3.2 111.4,2.8 112.3,3.1 118.7,6.9 120.1,6.9 115.2,7 112.4,6.9 108.1,6.8 146.1,7.5 143.6,7.4 134.2,12.7 144.3,11.3 148.9,30.3 154.7,29.8 133.3,38.4 158.7,51.9 153.9,53.3 156.9,62.4 159.1,62.4 155,65.7 155.4,71.9 158.1,77.6 111,40.5 112.4,39.8 116.4,40.7 115.5,39.6 89.2,31.3 88.7,37.8 87.2,37.3 90.7,37.4 88.9,25 84,24.4 82.6,23.2 83.1,21.4 85.1,21.4 75.2,26.2 75.1,24.8 75.8,23.8 66.1,23.1 68.2,21.5 72.4,23.3 72.2,30.7 70.6,30.9 70.3,28.3 41.6,22.2 36.8,32 37.8,32 13.8,22.5 12.8,22.5 14.8,21.1 14.2,18.9 12.3,18.1 12,9.6 29.5,7.3 31.6,7.3 9.7,88.2 8.8,89.2 55.7,116.9 56.5,115.5 51.9,58.1 53,56.3 53,54.2 57.7,60.4 67.6,62 59.2,54.7 64.2,54.6 68.6,54.5 74.5,52.1 79.7,52 84,51.9 87.1,51.6 89.3,49.4 61.2,57.1 66.4,57.2 71.5,57 79.5,57 84.3,57.3 89.2,57.1 94.9,57.3 99.6,57.2 104.9,57 109.9,57.2 132.7,49.7 127.8,49.5 123.2,49.4 119.9,49.6 107.3,49.6 102.4,49.5 97.2,49.6 84.1,49.3 79.4,49.5 71.9,49.3 66.3,49.4 61.5,49.3 56.9,49.5 51.5,49.4 48.7,47.2 56.5,46.8 42.5,50.8 36.1,51 34.1,51.2 48,54.5 29.4,48.4 21.6,48.1 21.7,52.9 54,47.2 84.6,47 91.7,46.9 99.7,46.7 104,46.9 125,52.1 130,52.1 121.4,43.4 102.4,34.7 39.4,14.7 36.5,17.7 31.5,3.3 19,6.1 89.9,63 16.7,102.4 149.8,43.6 154.8,48.6 155,70.7 155.4,76.9 155.4,81.9 155.4,91.9 155.4,96.9 154.8,103.2 7.4,61.5 10.2,63.3 9.7,54.8 17.3,55.9 6.2,41 2.8,28.2 2,37 3.1,15.9 3,7.4 3.1,80.1 2.3,87.5 2.4,95.9 2,102.6 7.6,110.4 11.3,118.5 2.3,68.9 3.2,74.7 10.1,45.9 143.5,100 143.6,94.3 144.1,89.1 143.1,83.7 148.8,79 142,71.7 144.4,65.1 143.1,61 143.2,53 149.8,48.6 151.2,111.3 143.5,103 151.3,12 152.3,4 152.3,24 152.3,28 149.3,22 152.3,41 152.3,36 157.3,87 152.3,116 76.3,72 68.3,86 111.3,27 6.8,3 3.8,22 3.8,91 1.8,119 20.3,88.6 50.8,20.1 50.8,18.1 50.8,16.1 50.8,14.2 50.8,12.2 50.8,10.2 50.8,5.4 50.8,3.4 52.8,3.1 54.8,3.1 53.2,5.6 54.7,5.6 53.2,10.2 53.2,13.2 53.2,15.2 53.2,17.2 53.2,19.2 53.2,21.2 61.2,13.2 55.1,10.8 57.1,10.8 59.1,10.8 62.3,10.8 85.5,19 83.5,19 80.7,19 78.7,19 76.7,19 74.8,17 74.8,15 74.8,13 74.8,11 72.5,10.2 72.4,12.2 72.4,14.2 72.4,16.2 72.4,18.2 72.4,20.2 74,21.4 78,21.4 80,21.4 87.1,21.4
  pour Top (isolate 0.2, no thermals): -60,150 -60,-30 225,-30 225,150
  pour Bottom (isolate 0.2, no thermals): -65,155 235,155 235,-35 -65,-35
GYRO_I2C_SCL  (via drill 0.2)  (1 unrouted)
  Top 0.2: 108.6,48.25 108.6,44 v40.6,44
  Bottom 0.2: v40.6,44 28.9,44 28.9,14.6 34.7,14.6 34.7,9.7 33.11,9.7 J5.2
GYRO_I2C_SDA  (via drill 0.2)
  Top 0.2: A1.CN11_53 111.11,47 109.6,47 109.6,43 v40.6,43
  Bottom 0.2: v40.6,43 29.9,43 29.9,15.6 35.7,15.6 35.7,8.17 J5.1
JOYSTICK_SW  (via drill 0.2)
  Top 0.2: v129.8,12 v128.6,12
  Bottom 0.2: A1.CN11_59 118.73,46.7 137.2,46.7 137.2,16.3 128.6,16.3 v128.6,12 | J9.10 135.46,12 v129.8,12
N$1
  Top 0.2: J3.3 114.29,8.2 R14.1
N$2
  Top 0.4: C3.2 49,32 R1.2 R5.1
N$3
  Top 0.4: R16.2 147.5,39.4 147.5,36.85 | 147.5,36.85 147.5,35.94 U1.7 | R15.1 147.5,36.85
N$5
  Top 0.4: U1.2 136,35.94 C12.2
N$6
  Top 0.4: U1.4 136,33.4 C12.1
N$19
  Top 0.4: R3.2 39.15,29.15 | 39.15,29.15 R2.2 | R4.1 39.15,29.15
N$20
  Top 0.4: TS53YL104MR10.1 51,35.35 R5.2
N$21
  Top 0.4: TS53YL104MR10.2 59.8,36.5 R6.1
N$22
  Top 0.4: R8.2 48.35,22.15 C4.1
N$23
  Top 0.4: IC2.1 76.65,29.41 R11.1
N$24
  Top 0.4: IC2.3 70,26.86 TS53YL104MR1.2
N$25
  Top 0.4: R11.2 C9.1
N$26
  Top 0.4: C9.2 82.21,32 IC2.8
N$27
  Top 0.4: R12.2 TS53YL104MR1.1
N$28
  Top 0.4: IC2.7 85.3,28.14 85.3,33.5 89,33.5 C5.+
N$29
  Top 0.4: IC2.5 85.35,25.59 C8.1 89,22.8 C7.+
POWERAMP_AUDIO_OUT
  Top 0.4: C7.- 89,20.2 73.6,20.2 73.6,8.23 J7.2
PREAMP_AUDIO_OUT  (via drill 0.2)
  Top 0.4: C4.2 52,22.2 R9.2 v52,12 64.32,12 J6.2 | v52,4.4 52,4.34 J6.3
  Bottom 0.4: v52,12 v52,4.4
SD_CLK
  Bottom 0.2: J8.4 9,74.9 32.3,74.9 32.3,48.3 45.07,48.3 A1.CN11_1
SD_CS
  Bottom 0.2: J8.2 9,80 45.3,80 45.3,98.4 73.9,98.4 73.9,96.5 94.6,96.5 94.6,111.75 A1.CN12_42
SD_DI  (via drill 0.2)
  Top 0.2: v71.8,97.4 v71.8,99.6
  Bottom 0.2: J8.3 10.3,77.42 10.3,79 46.3,79 46.3,97.4 v71.8,97.4 | v71.8,99.6 71.8,111.75 A1.CN12_22
SD_DO
  Bottom 0.2: J8.5 10.3,72.34 10.3,73.9 31.3,73.9 31.3,47.3 43,47.3 43,46.9 46.3,46.9 46.3,50.79 A1.CN11_2

### Text on the board
Document: HEAD | LEFT ARM | RIGHT ARM | FEET
PRINT: R | T | +3V3 | P | CS | U | B / E / R / L / I / N | The / Body-Synth | DI | CLK | Q | DO | DSP-LAB SS21 | GND | S | -5V | IN | AGND | PREAMP | PWR AMP | CAP+ | FB | GND | !SHDN! | CAP- | OUT | 1OUT | GAIN | VCC+ | GAIN | 1IN- | 2OUT | IN- | BYPASS | DAC_OUT1 | 1IN+ | 2IN- | IN+ | VCC | VCC- | 2IN+ | GND | OUT | DAC_OUT2 | OUT | O / U / T | OUT | HEAD- / PHONES | EMG | GYRO | SPEAKER | EQ | KEYS | USER INTERFACE | + / 5 / V | G / N / D | D / C | A / C | - / 5 / V | 3 / V / 3 | G / N / D | S / C / L | S / D / A | T / I / P | O / U / T | G / N / D | O / U / T | + / 5 / V | G / N / D | - / 5 / V | P / E / N | 3 / V / 3 | G / N / D | R / I / N / G | S / L / E